# EAGLE schematic GBA SP schematic (EAGLE 7.6.0)

## Sheet 1 of 10
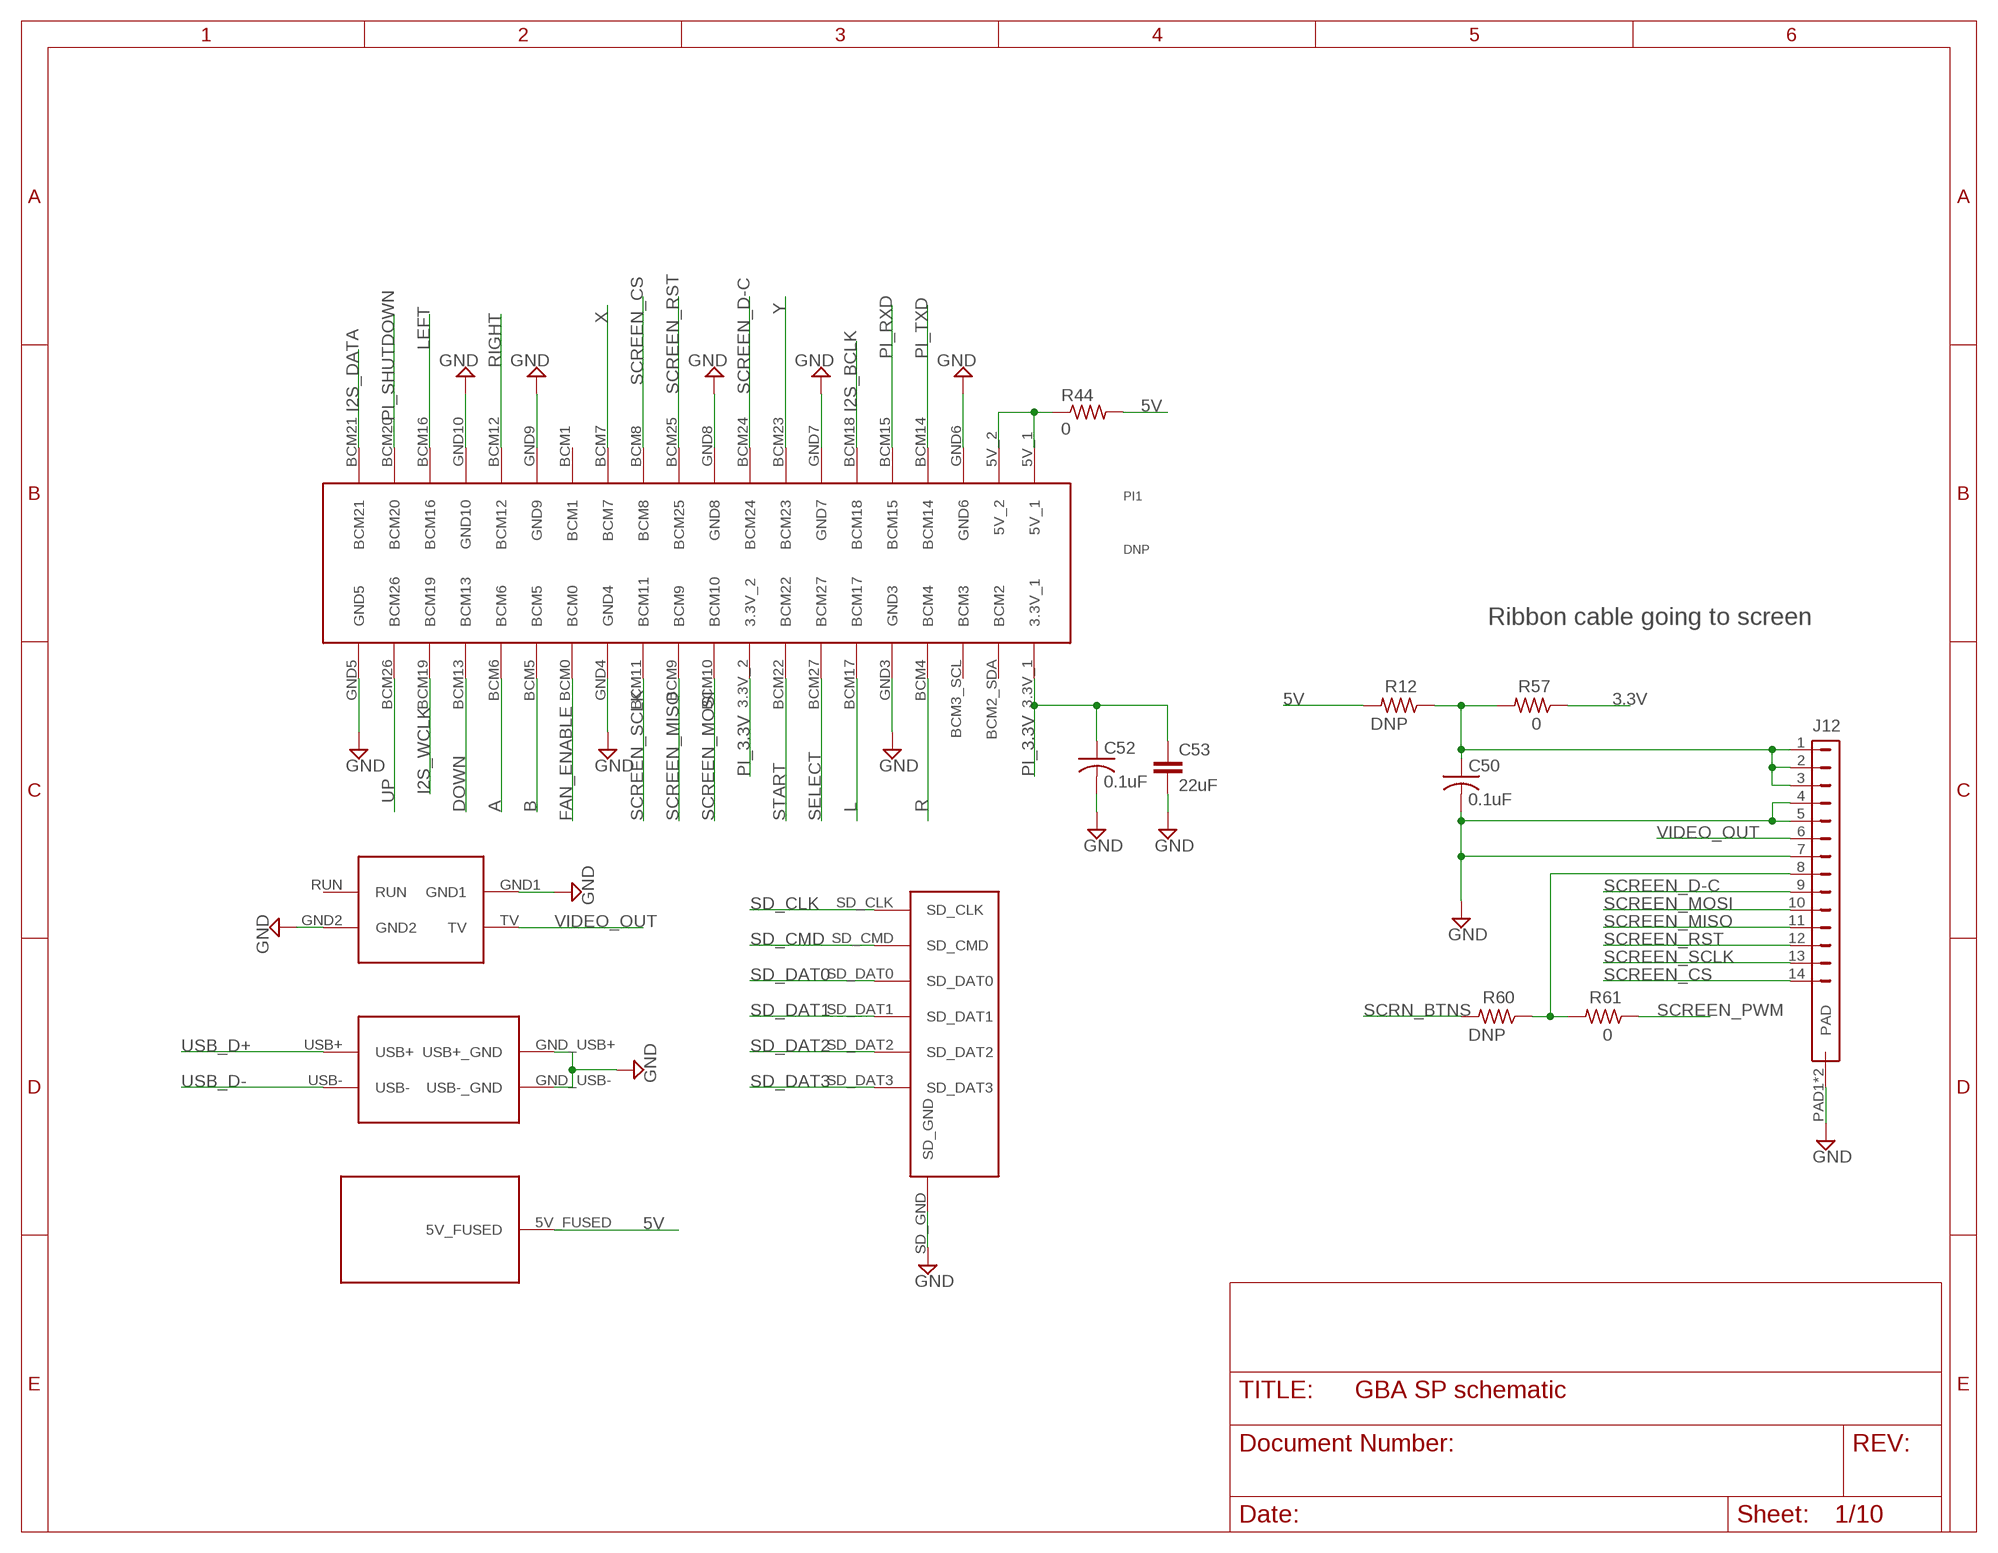
[diagram p0: schematic, sheet 1]

### Parts
C50  0.1uF  C-US0402_REAL  [0402_REAL]
C52  0.1uF  C-US0402_REAL  [0402_REAL]
C53  22uF  C-EUC0805  [C0805]
J12  FPC_14  [FPC_14]
PI1  DNP  PI-ZERO  [PI-ZERO]
R12  DNP  R-US_R0603  [R0603]
R44  0  R-US_R0805  [R0805]
R57  0  R-US_R0603  [R0603]
R60  DNP  R-US_0402_REAL  [0402_REAL]
R61  0  R-US_0402_REAL  [0402_REAL]

### Nets
3.3V: R57.1 ; also sheet 10
5V: PI1.5V_FUSED R12.2 R44.2 ; also sheet 2,3,4,5,6,7,10
A: PI1.BCM6 ; also sheet 2
B: PI1.BCM5 ; also sheet 2
DOWN: PI1.BCM13 ; also sheet 2
FAN_ENABLE: PI1.BCM0 ; also sheet 10
GND: C50.2 C52.2 C53.2 J12.4 J12.5 J12.7 J12.PAD1(PAD) J12.PAD2(PAD) PI1.GND1 PI1.GND2 PI1.GND3 PI1.GND4 PI1.GND5 PI1.GND6 PI1.GND7 PI1.GND8 PI1.GND9 PI1.GND10 PI1.GND_USB+(USB+_GND) PI1.GND_USB-(USB-_GND) PI1.SD_GND ; also sheet 2,3,4,5,6,7,10
I2S_BCLK: PI1.BCM18 ; also sheet 4
I2S_DATA: PI1.BCM21 ; also sheet 4
I2S_WCLK: PI1.BCM19 ; also sheet 4
L: PI1.BCM17 ; also sheet 2
LEFT: PI1.BCM16 ; also sheet 2
N$19: PI1.5V_1 PI1.5V_2 R44.1
N$22: J12.8 R60.1 R61.2
N$23: C50.1 J12.1 J12.2 J12.3 R12.1 R57.2
PI_3.3V: C52.1 C53.1 PI1.3.3V_1 PI1.3.3V_2 ; also sheet 4,6
PI_RXD: PI1.BCM15 ; also sheet 6
PI_SHUTDOWN: PI1.BCM20 ; also sheet 6
PI_TXD: PI1.BCM14 ; also sheet 6
R: PI1.BCM4 ; also sheet 2
RIGHT: PI1.BCM12 ; also sheet 2
SCREEN_CS: J12.14 PI1.BCM8
SCREEN_D-C: J12.9 PI1.BCM24
SCREEN_MISO: J12.11 PI1.BCM9
SCREEN_MOSI: J12.10 PI1.BCM10
SCREEN_PWM: R61.1 ; also sheet 6
SCREEN_RST: J12.12 PI1.BCM25
SCREEN_SCLK: J12.13 PI1.BCM11
SCRN_BTNS: R60.2 ; also sheet 2
SD_CLK: PI1.SD_CLK
SD_CMD: PI1.SD_CMD
SD_DAT0: PI1.SD_DAT0
SD_DAT1: PI1.SD_DAT1
SD_DAT2: PI1.SD_DAT2
SD_DAT3: PI1.SD_DAT3
SELECT: PI1.BCM27 ; also sheet 2
START: PI1.BCM22 ; also sheet 2
UP: PI1.BCM26 ; also sheet 2
USB_D+: PI1.USB+ ; also sheet 7
USB_D-: PI1.USB- ; also sheet 7
VIDEO_OUT: J12.6 PI1.TV
X: PI1.BCM7 ; also sheet 2
Y: PI1.BCM23 ; also sheet 2
Unconnected: PI1.BCM1 PI1.BCM2_SDA(BCM2) PI1.BCM3_SCL(BCM3) PI1.RUN

### Notes on the sheet
- Ribbon cable going to screen

## Sheet 2 of 10
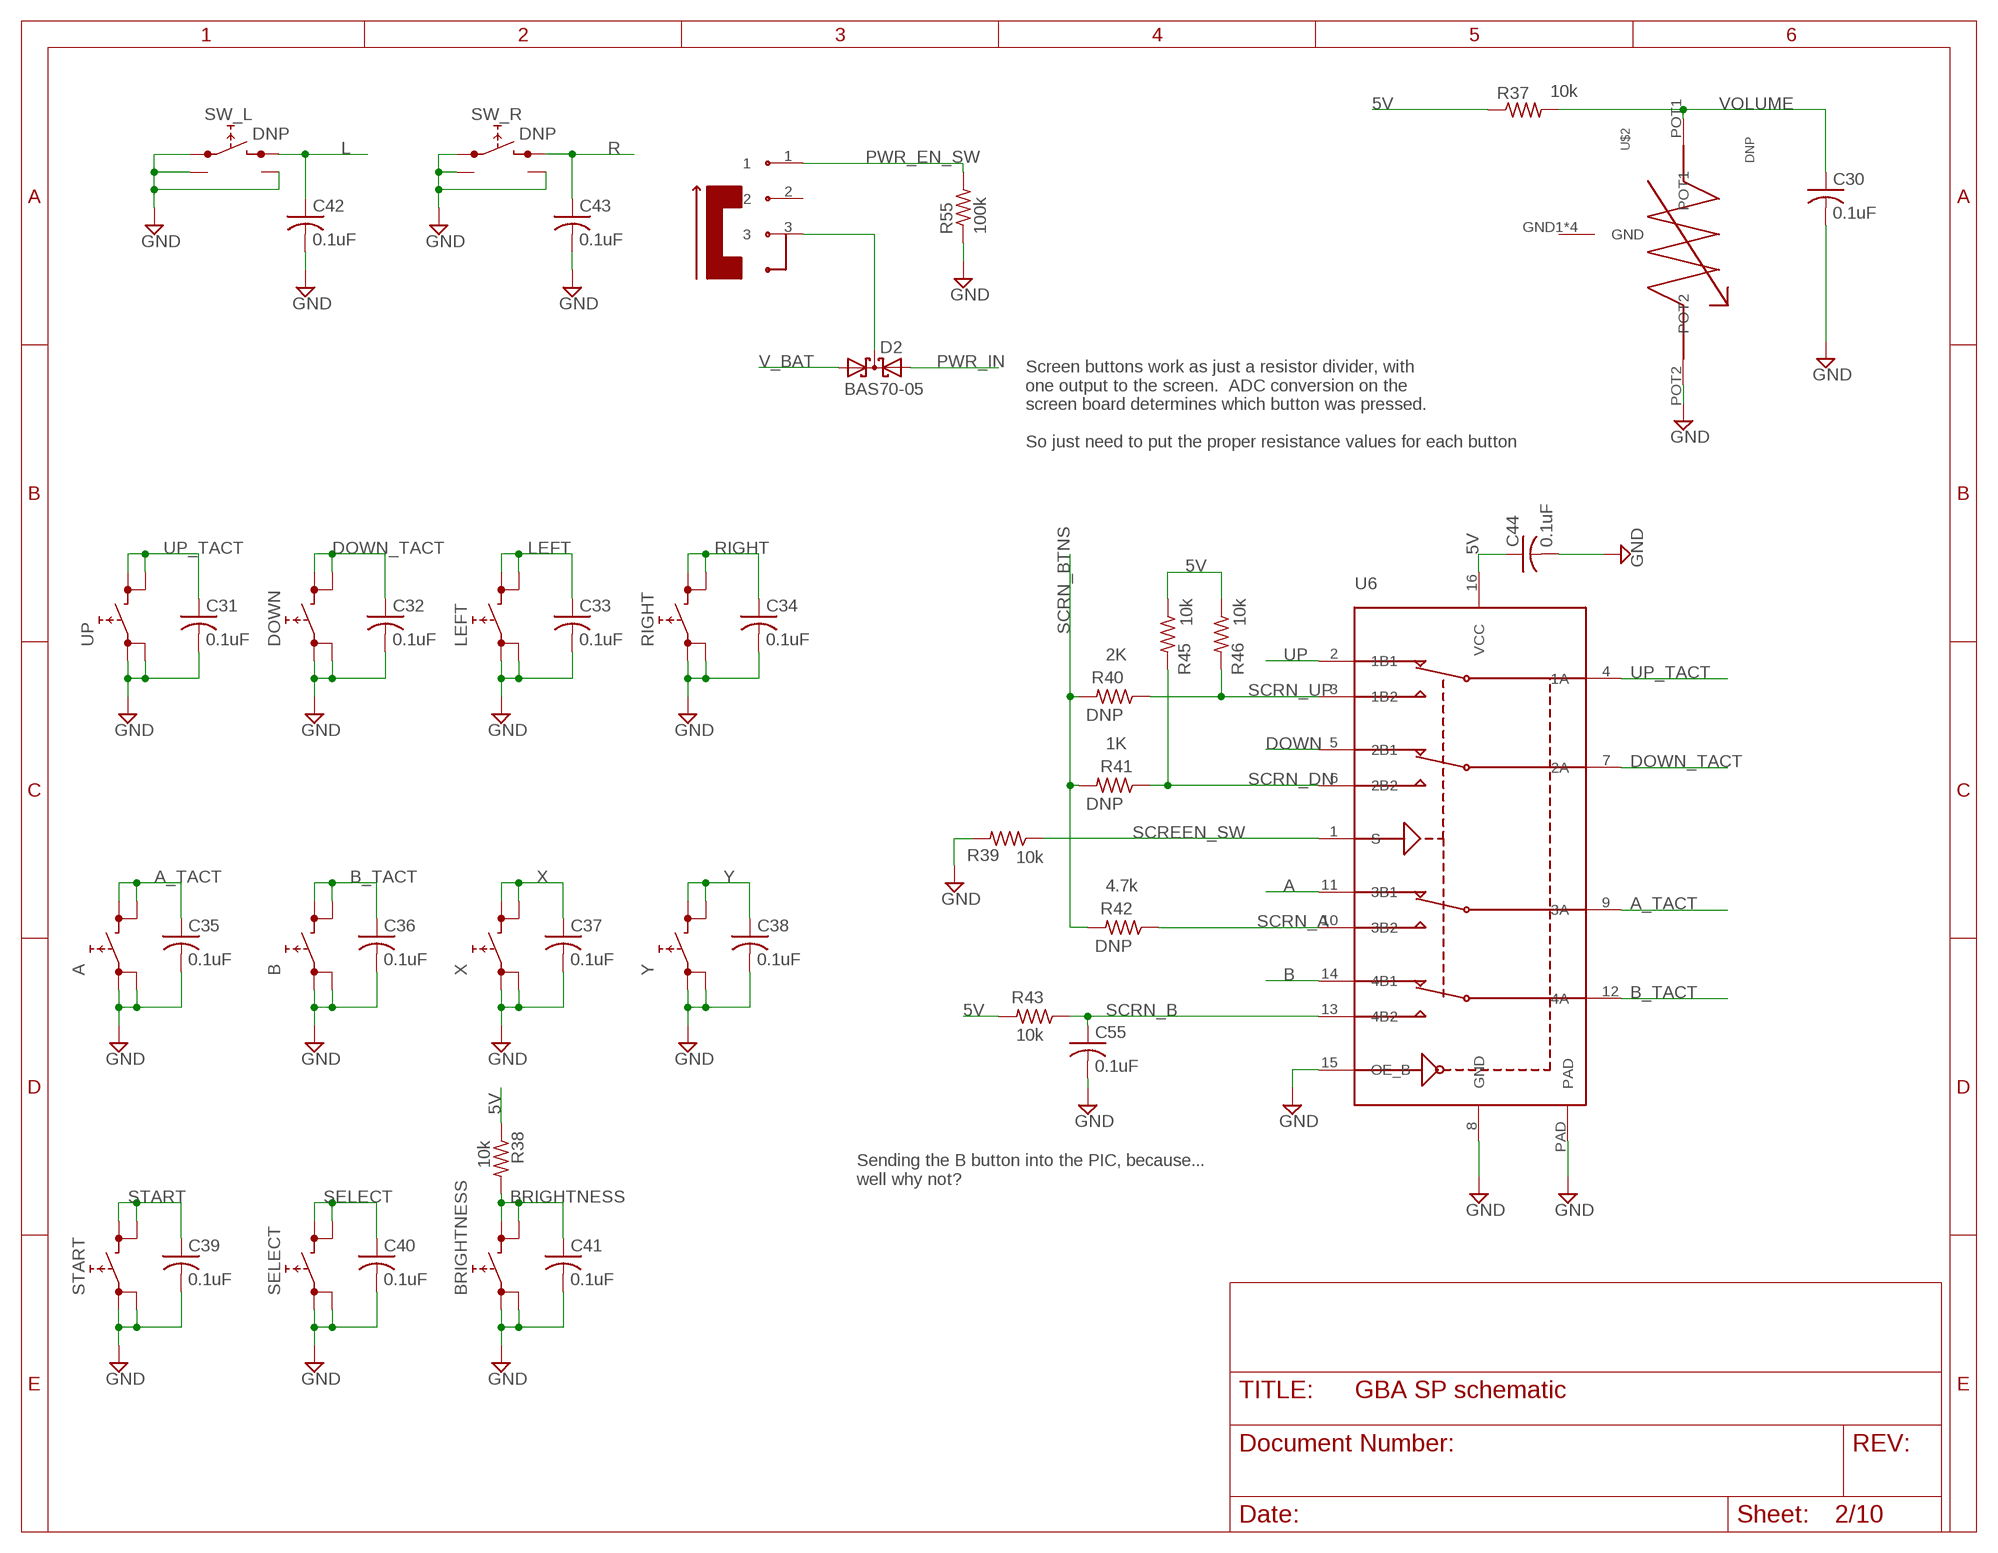
[diagram p1: schematic, sheet 2]

### Parts
A  TACTILEGBA_SP  [GBA_SP_TACT]
B  TACTILEGBA_SP  [GBA_SP_TACT]
BRIGHTNESS  TACTILE  [TL3315]
C30  0.1uF  C-US0402_REAL  [0402_REAL]
C31  0.1uF  C-US0402_REAL  [0402_REAL]
C32  0.1uF  C-US0402_REAL  [0402_REAL]
C33  0.1uF  C-US0402_REAL  [0402_REAL]
C34  0.1uF  C-US0402_REAL  [0402_REAL]
C35  0.1uF  C-US0402_REAL  [0402_REAL]
C36  0.1uF  C-US0402_REAL  [0402_REAL]
C37  0.1uF  C-US0402_REAL  [0402_REAL]
C38  0.1uF  C-US0402_REAL  [0402_REAL]
C39  0.1uF  C-US0402_REAL  [0402_REAL]
C40  0.1uF  C-US0402_REAL  [0402_REAL]
C41  0.1uF  C-US0402_REAL  [0402_REAL]
C42  0.1uF  C-US0402_REAL  [0402_REAL]
C43  0.1uF  C-US0402_REAL  [0402_REAL]
C44  0.1uF  C-US0402_REAL  [0402_REAL]
C55  0.1uF  C-US0402_REAL  [0402_REAL]
D2  BAS70-05  [SOT23]
DOWN  TACTILEGBA_SP  [GBA_SP_TACT]
LEFT  TACTILEGBA_SP  [GBA_SP_TACT]
R37  10k  R-US_0402_REAL  [0402_REAL]
R38  10k  R-US_0402_REAL  [0402_REAL]
R39  10k  R-US_0402_REAL  [0402_REAL]
R40  DNP  R-US_0402_REAL  [0402_REAL]
R41  DNP  R-US_0402_REAL  [0402_REAL]
R42  DNP  R-US_0402_REAL  [0402_REAL]
R43  10k  R-US_0402_REAL  [0402_REAL]
R45  10k  R-US_0402_REAL  [0402_REAL]
R46  10k  R-US_0402_REAL  [0402_REAL]
R55  100k  R-US_0402_REAL  [0402_REAL]
RIGHT  TACTILEGBA_SP  [GBA_SP_TACT]
SELECT  TACTILE  [TL3315]
START  TACTILE  [TL3315]
SW_L  DNP  GBA-SHOULDER-SW  [GBA-SHOULDER-SW]
SW_R  DNP  GBA-SHOULDER-SW  [GBA-SHOULDER-SW]
U6  SN74CBT3257C  [VQFN16]
U$1  CSS-1210  [CSS-1210]
U$2  DNP  GBA-POT  [GBA-POT]
UP  TACTILEGBA_SP  [GBA_SP_TACT]
X  TACTILEGBA_SP  [GBA_SP_TACT]
Y  TACTILEGBA_SP  [GBA_SP_TACT]

### Nets
5V: C44.1 R37.1 R38.1 R43.2 R45.1 R46.1 U6.16(VCC) ; also sheet 1,3,4,5,6,7,10
A: U6.11(3B1) ; also sheet 1
A_TACT: A.2 A.4 C35.1 U6.9(3A)
B: U6.14(4B1) ; also sheet 1
B_TACT: B.2 B.4 C36.1 U6.12(4A)
BRIGHTNESS: BRIGHTNESS.3 BRIGHTNESS.4 C41.1 R38.2 ; also sheet 6
DOWN: U6.5(2B1) ; also sheet 1
DOWN_TACT: C32.1 DOWN.2 DOWN.4 U6.7(2A)
GND: A.1 A.3 B.1 B.3 BRIGHTNESS.1 BRIGHTNESS.2 C30.2 C31.2 C32.2 C33.2 C34.2 C35.2 C36.2 C37.2 C38.2 C39.2 C40.2 C41.2 C42.2 C43.2 C44.2 C55.2 DOWN.1 DOWN.3 LEFT.1 LEFT.3 R39.2 R55.1 RIGHT.1 RIGHT.3 SELECT.1 SELECT.2 START.1 START.2 SW_L.A SW_L.GND1 SW_L.GND2 SW_R.A SW_R.GND1 SW_R.GND2 U6.8(GND) U6.15(OE_B) U6.PAD U$2.POT2 UP.1 UP.3 X.1 X.3 Y.1 Y.3 ; also sheet 1,3,4,5,6,7,10
L: C42.1 SW_L.B ; also sheet 1
LEFT: C33.1 LEFT.2 LEFT.4 ; also sheet 1
N$25: D2.3(C) U$1.3
PWR_EN_SW: R55.2 U$1.1 ; also sheet 3
PWR_IN: D2.2(A2) ; also sheet 3,5,7
R: C43.1 SW_R.B ; also sheet 1
RIGHT: C34.1 RIGHT.2 RIGHT.4 ; also sheet 1
SCREEN_SW: R39.1 U6.1(S) ; also sheet 6
SCRN_A: R42.1 U6.10(3B2)
SCRN_B: C55.1 R43.1 U6.13(4B2) ; also sheet 6
SCRN_BTNS: R40.2 R41.2 R42.2 ; also sheet 1
SCRN_DN: R41.1 R45.2 U6.6(2B2) ; also sheet 6
SCRN_UP: R40.1 R46.2 U6.3(1B2) ; also sheet 6
SELECT: C40.1 SELECT.3 SELECT.4 ; also sheet 1
START: C39.1 START.3 START.4 ; also sheet 1
UP: U6.2(1B1) ; also sheet 1
UP_TACT: C31.1 U6.4(1A) UP.2 UP.4
V_BAT: D2.1(A1) ; also sheet 3,5
VOLUME: C30.1 R37.2 U$2.POT1 ; also sheet 6
X: C37.1 X.2 X.4 ; also sheet 1
Y: C38.1 Y.2 Y.4 ; also sheet 1
Unconnected: U$1.2 U$2.GND1(GND) U$2.GND2(GND) U$2.GND3(GND) U$2.GND4(GND)

### Notes on the sheet
- Screen buttons work as just a resistor divider, with
  one output to the screen.  ADC conversion on the
  screen board determines which button was pressed.  
  
  So just need to put the proper resistance values for each button
- 2K
- 1K
- 4.7k
- Sending the B button into the PIC, because...
  well why not?

## Sheet 3 of 10
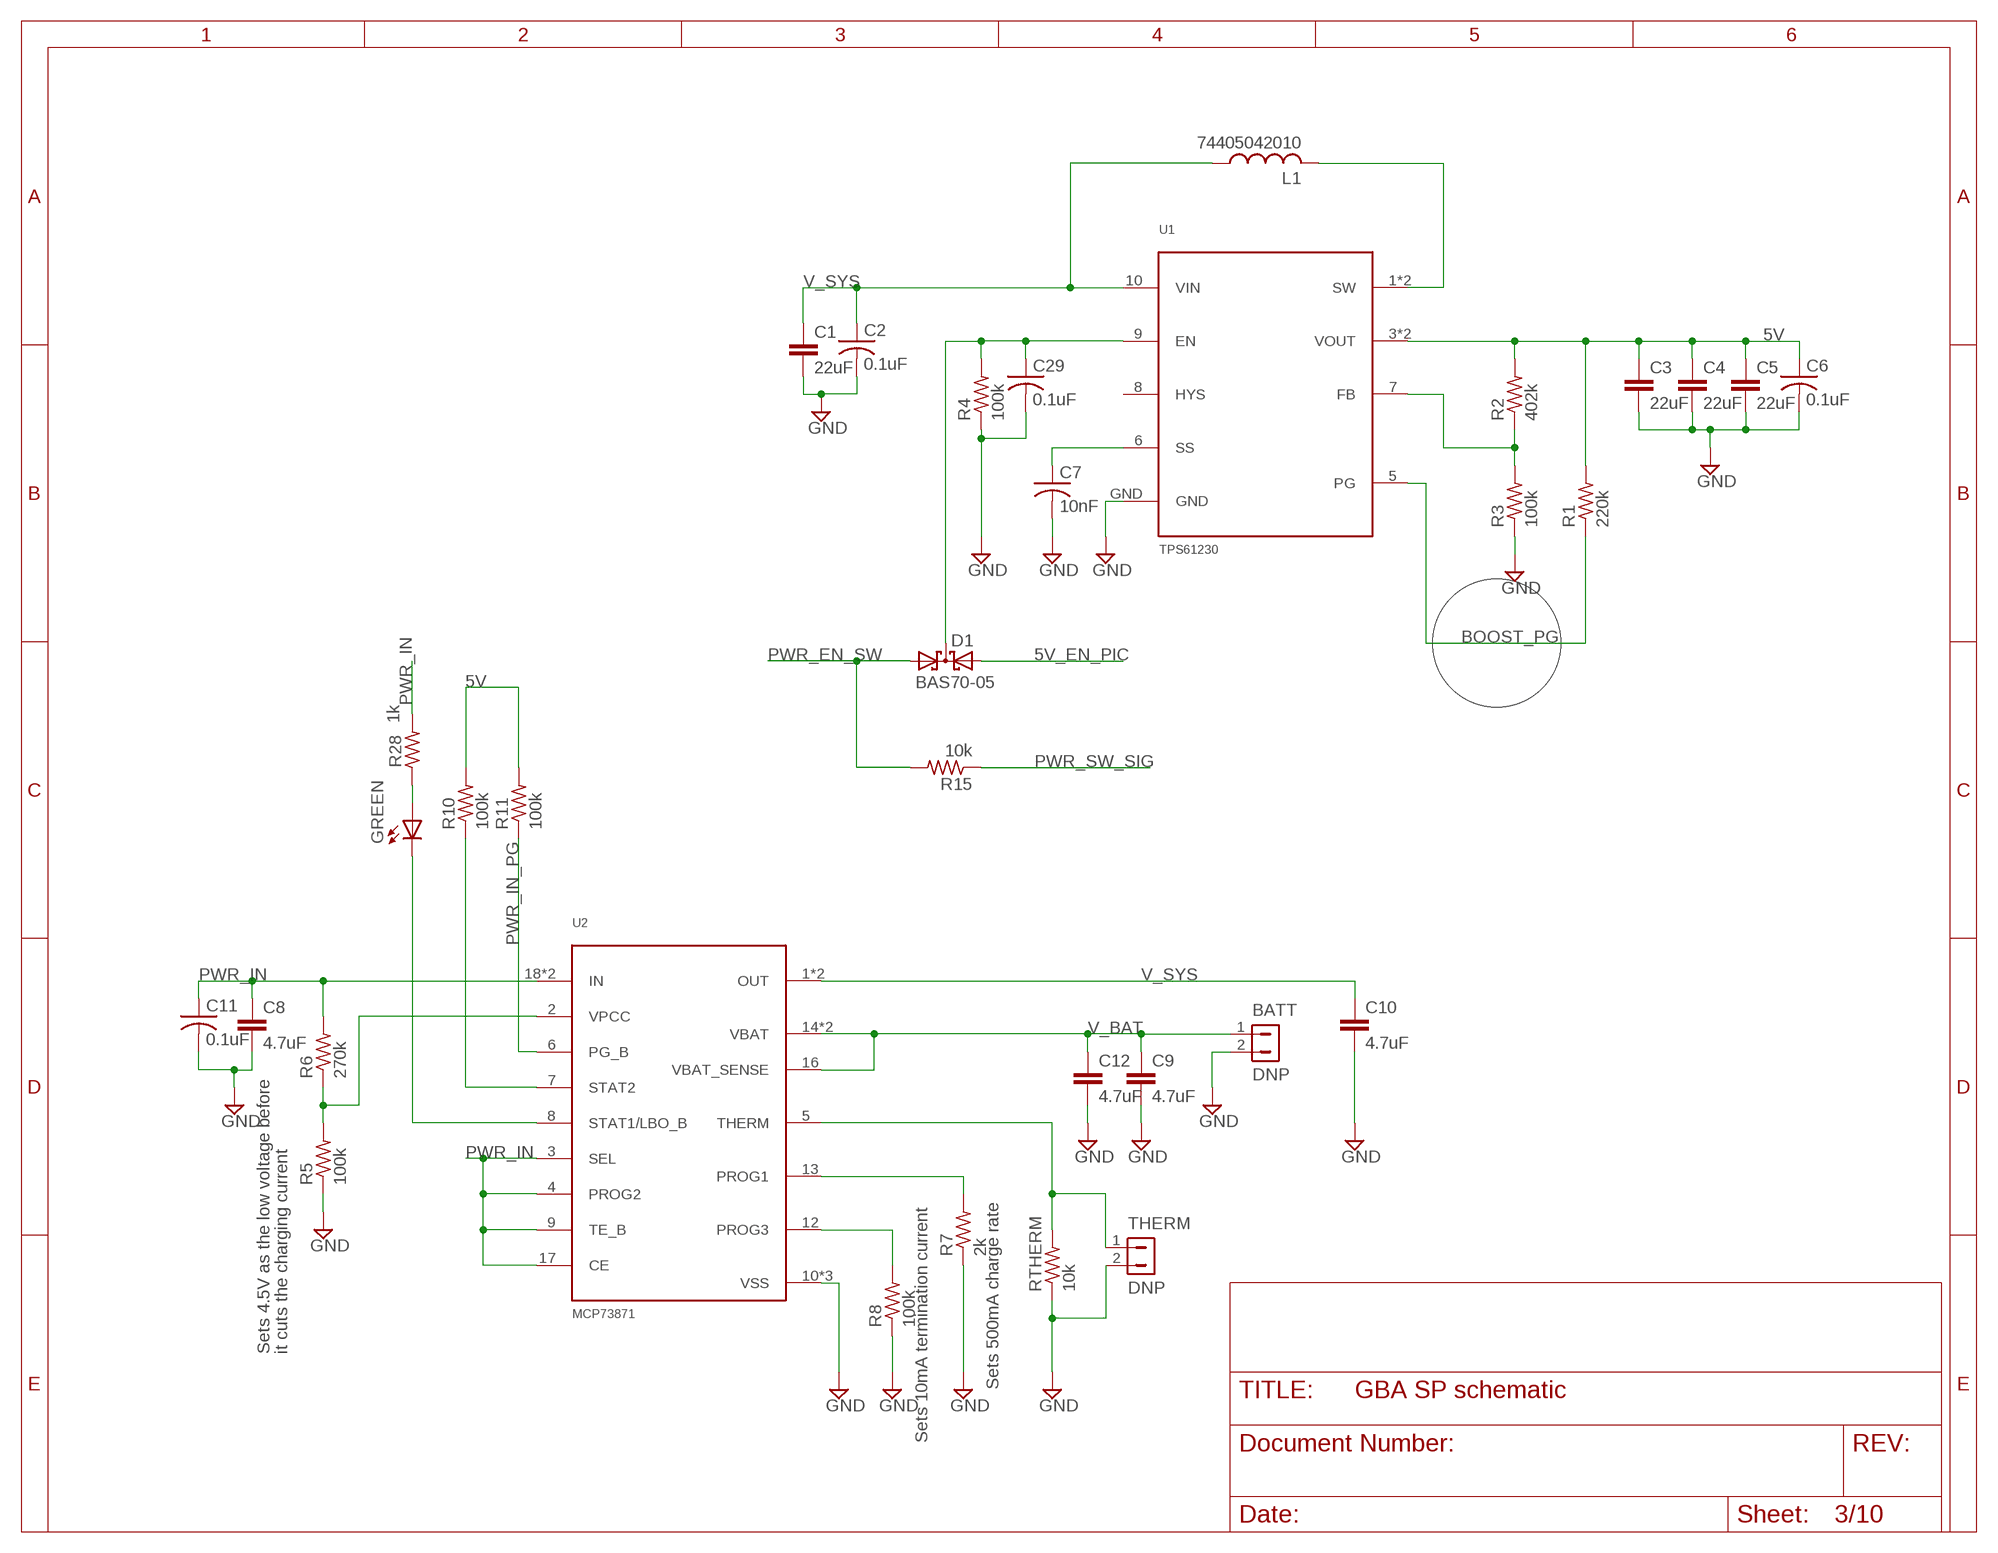
[diagram p2: schematic, sheet 3]

### Parts
BATT  DNP  HEADER-1X2  [HEADER-1X2]
C1  22uF  C-EUC0805  [C0805]
C2  0.1uF  C-US0402_REAL  [0402_REAL]
C3  22uF  C-EUC0805  [C0805]
C4  22uF  C-EUC0805  [C0805]
C5  22uF  C-EUC0805  [C0805]
C6  0.1uF  C-US0402_REAL  [0402_REAL]
C7  10nF  C-US0402_REAL  [0402_REAL]
C8  4.7uF  C-EUC0603  [C0603]
C9  4.7uF  C-EUC0603  [C0603]
C10  4.7uF  C-EUC0603  [C0603]
C11  0.1uF  C-US0402_REAL  [0402_REAL]
C12  4.7uF  C-EUC0603  [C0603]
C29  0.1uF  C-US0402_REAL  [0402_REAL]
D1  BAS70-05  [SOT23]
GREEN  LEDCHIP-LED0603  [CHIP-LED0603]
L1  74405042010  XFL4020-102MEB  [XFL4020-102MEB]
R1  220k  R-US_R0603  [R0603]
R2  402k  R-US_0402_REAL  [0402_REAL]
R3  100k  R-US_0402_REAL  [0402_REAL]
R4  100k  R-US_0402_REAL  [0402_REAL]
R5  100k  R-US_0402_REAL  [0402_REAL]
R6  270k  R-US_R0603  [R0603]
R7  2k  R-US_0402_REAL  [0402_REAL]
R8  100k  R-US_0402_REAL  [0402_REAL]
R10  100k  R-US_0402_REAL  [0402_REAL]
R11  100k  R-US_0402_REAL  [0402_REAL]
R15  10k  R-US_0402_REAL  [0402_REAL]
R28  1k  R-US_0402_REAL  [0402_REAL]
RTHERM  10k  R-US_0402_REAL  [0402_REAL]
THERM  DNP  DF13-2THIN  [DF13-2_THIN]
U1  TPS61230  [VSON10]
U2  MCP73871  [QFN20]

### Nets
5V: C3.1 C4.1 C5.1 C6.1 R1.2 R2.2 R10.2 R11.2 U1.3(VOUT) U1.4(VOUT) ; also sheet 1,2,4,5,6,7,10
5V_EN_PIC: D1.2(A2) ; also sheet 6
BOOST_PG: R1.1 U1.5(PG)
GND: BATT.2 C1.2 C2.2 C3.2 C4.2 C5.2 C6.2 C7.2 C8.2 C9.2 C10.2 C11.2 C12.2 C29.2 R3.1 R4.1 R5.1 R7.1 R8.1 RTHERM.1 THERM.2 U1.GND U2.10(VSS) U2.11(VSS) U2.PAD(VSS) ; also sheet 1,2,4,5,6,7,10
N$1: C29.1 D1.3(C) R4.2 U1.9(EN)
N$2: L1.2 U1.1(SW) U1.2(SW)
N$3: R2.1 R3.2 U1.7(FB)
N$4: R7.2 U2.13(PROG1)
N$5: R5.2 R6.1 U2.2(VPCC)
N$6: C7.1 U1.6(SS)
N$7: R8.2 U2.12(PROG3)
N$8: RTHERM.2 THERM.1 U2.5(THERM)
N$21: GREEN.A R28.1
PWR_EN_SW: D1.1(A1) R15.2 ; also sheet 2
PWR_IN: C8.1 C11.1 R6.2 R28.2 U2.3(SEL) U2.4(PROG2) U2.9(TE_B) U2.17(CE) U2.18(IN) U2.19(IN) ; also sheet 2,5,7
PWR_IN_PG: R11.1 U2.6(PG_B) ; also sheet 6
PWR_SW_SIG: R15.1 ; also sheet 6
STAT1: GREEN.C U2.8(STAT1/LBO_B)
STAT2: R10.1 U2.7(STAT2)
V_BAT: BATT.1 C9.1 C12.1 U2.14(VBAT) U2.15(VBAT) U2.16(VBAT_SENSE) ; also sheet 2,5
V_SYS: C1.1 C2.1 C10.1 L1.1 U1.10(VIN) U2.1(OUT) U2.20(OUT)
Unconnected: U1.8(HYS)

### Notes on the sheet
- Sets 4.5V as the low voltage before | it cuts the charging current
- Sets 500mA charge rate
- Sets 10mA termination current

## Sheet 4 of 10
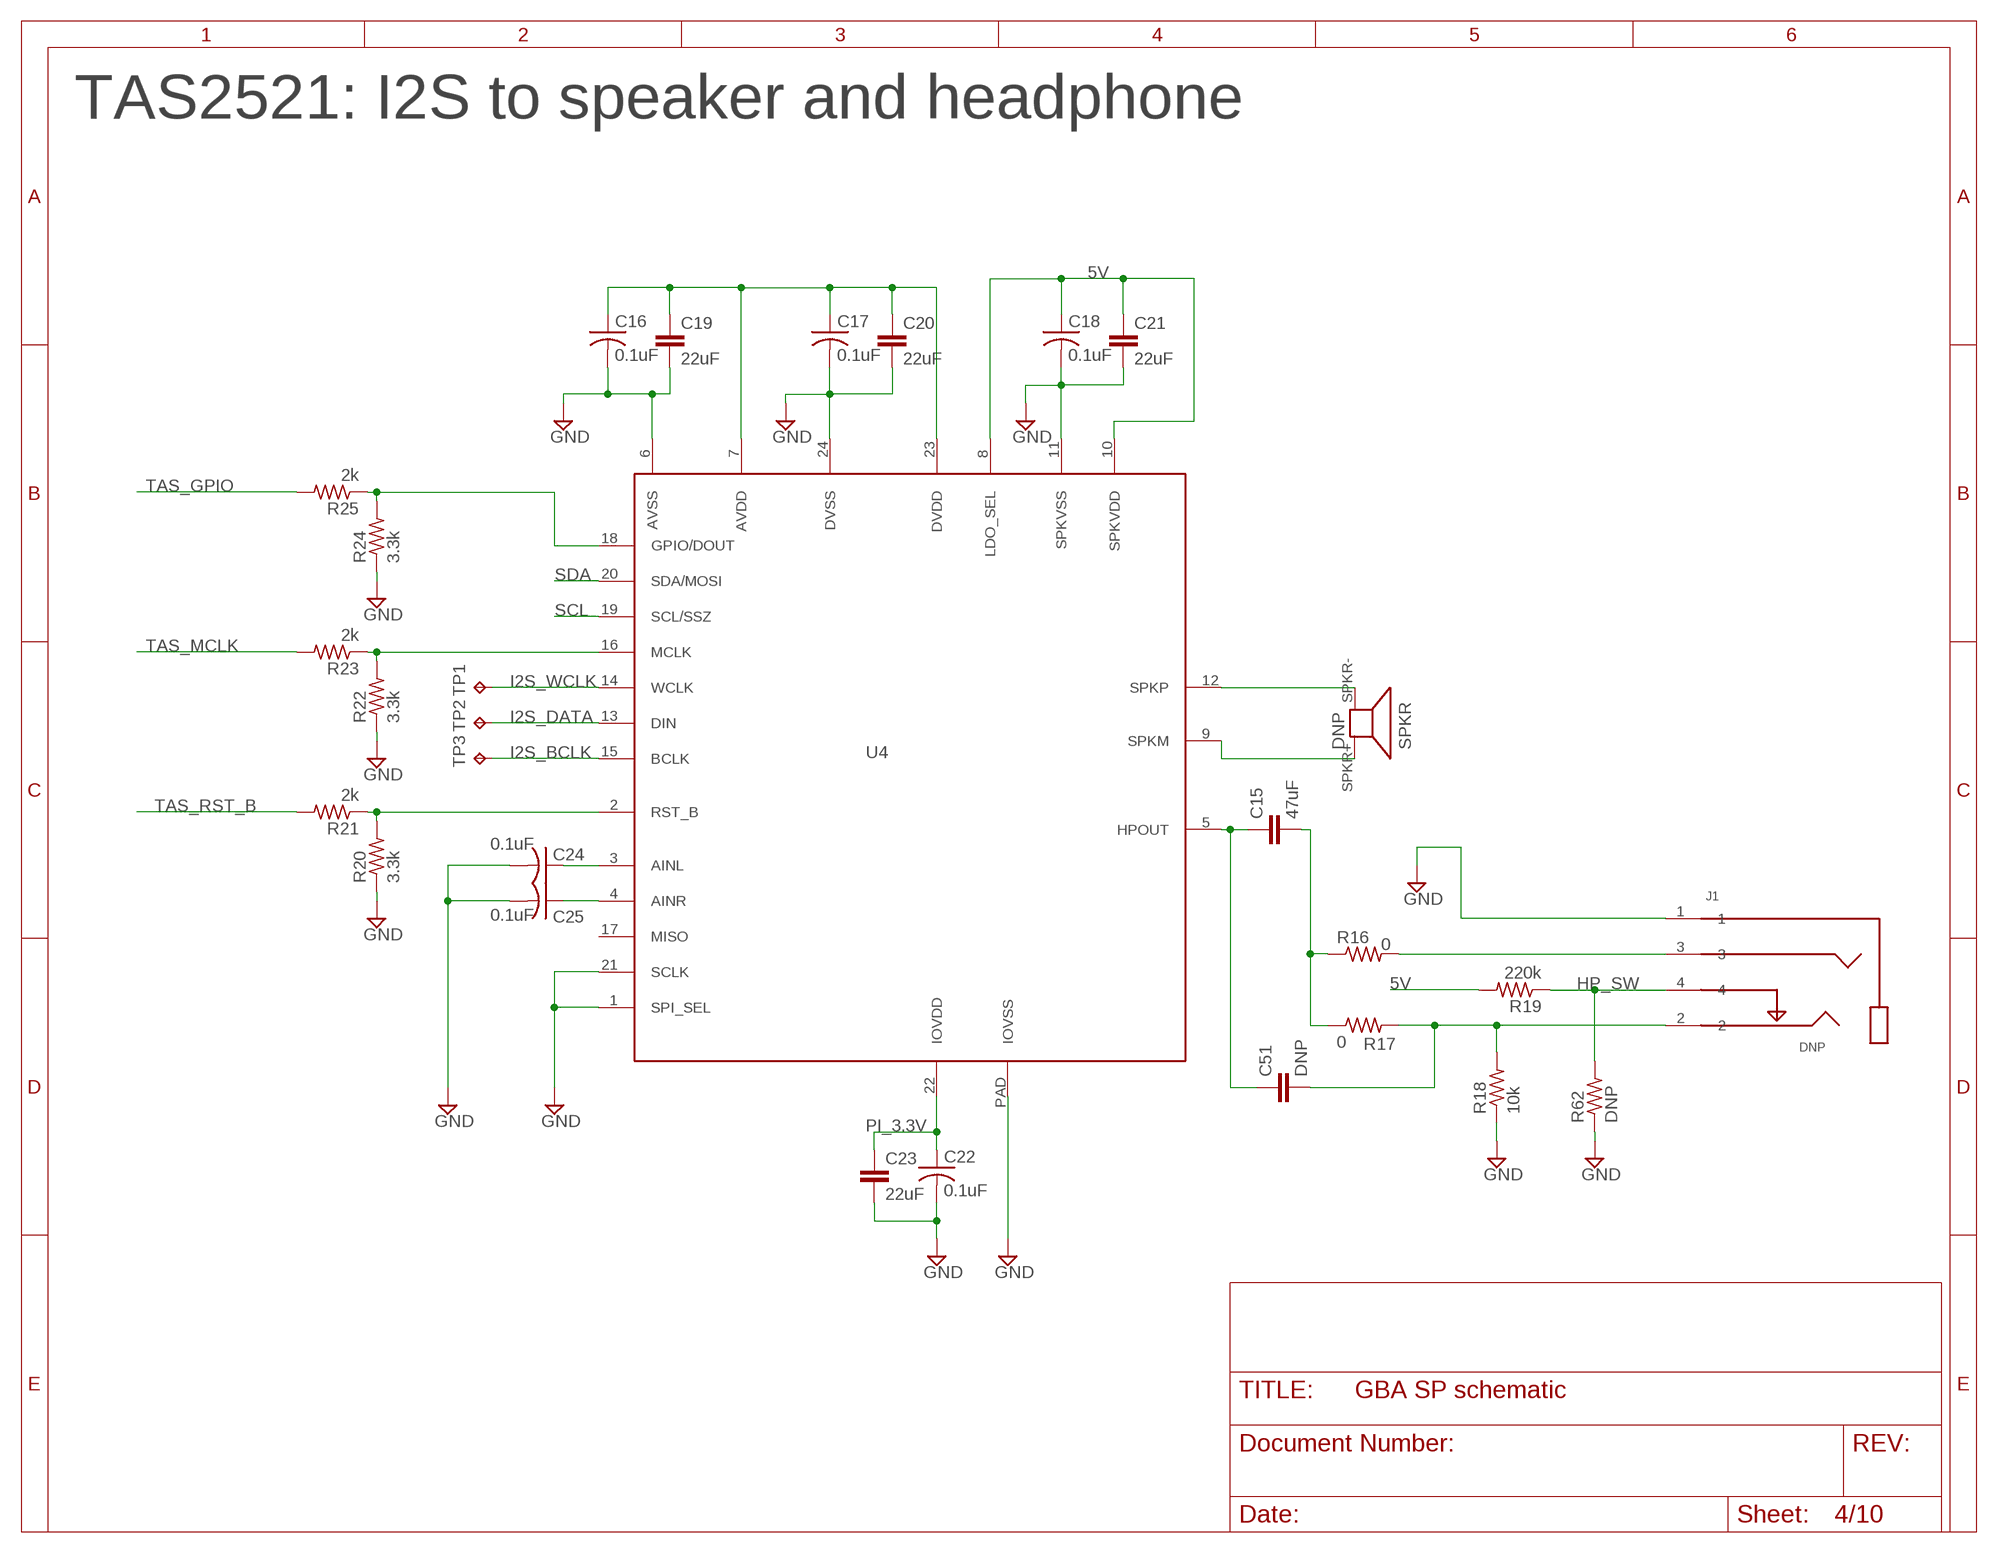
[diagram p3: schematic, sheet 4]

### Parts
C15  47uF  C-EUC0805  [C0805]
C16  0.1uF  C-US0402_REAL  [0402_REAL]
C17  0.1uF  C-US0402_REAL  [0402_REAL]
C18  0.1uF  C-US0402_REAL  [0402_REAL]
C19  22uF  C-EUC0805  [C0805]
C20  22uF  C-EUC0805  [C0805]
C21  22uF  C-EUC0805  [C0805]
C22  0.1uF  C-US0402_REAL  [0402_REAL]
C23  22uF  C-EUC0805  [C0805]
C24  0.1uF  C-US0402_REAL  [0402_REAL]
C25  0.1uF  C-US0402_REAL  [0402_REAL]
C51  DNP  C-EUC0805  [C0805]
J1  DNP  HEADPHONE_JACK  [HEADPHONE_JACK]
R16  0  R-US_0402_REAL  [0402_REAL]
R17  0  R-US_0402_REAL  [0402_REAL]
R18  10k  R-US_0402_REAL  [0402_REAL]
R19  220k  R-US_R0603  [R0603]
R20  3.3k  R-US_0402_REAL  [0402_REAL]
R21  2k  R-US_0402_REAL  [0402_REAL]
R22  3.3k  R-US_0402_REAL  [0402_REAL]
R23  2k  R-US_0402_REAL  [0402_REAL]
R24  3.3k  R-US_0402_REAL  [0402_REAL]
R25  2k  R-US_0402_REAL  [0402_REAL]
R62  DNP  R-US_0402_REAL  [0402_REAL]
SPKR  DNP  GBA-SPKR  [GBA-SPKR]
TP1  TPTP06R  [TP06R]
TP2  TPTP06R  [TP06R]
TP3  TPTP06R  [TP06R]
U4  TAS2521  [QFN24]

### Nets
5V: C18.1 C21.1 R19.2 U4.8(LDO_SEL) U4.10(SPKVDD) ; also sheet 1,2,3,5,6,7,10
GND: C16.2 C17.2 C18.2 C19.2 C20.2 C21.2 C22.2 C23.2 C24.2 C25.2 J1.1 R18.1 R20.1 R22.1 R24.1 R62.1 U4.1(SPI_SEL) U4.6(AVSS) U4.11(SPKVSS) U4.21(SCLK) U4.24(DVSS) U4.PAD(IOVSS) ; also sheet 1,2,3,5,6,7,10
HP_SW: J1.4 R19.1 R62.2 ; also sheet 6
I2S_BCLK: TP3.TP U4.15(BCLK) ; also sheet 1
I2S_DATA: TP2.TP U4.13(DIN) ; also sheet 1
I2S_WCLK: TP1.TP U4.14(WCLK) ; also sheet 1
N$10: SPKR.SPKR-(-) U4.12(SPKP)
N$11: SPKR.SPKR+(+) U4.9(SPKM)
N$12: C15.1 C51.1 U4.5(HPOUT)
N$13: C15.2 R16.1 R17.1
N$14: J1.3 R16.2
N$15: C51.2 J1.2 R17.2 R18.2
N$16: C16.1 C17.1 C19.1 C20.1 U4.7(AVDD) U4.23(DVDD)
N$26: R20.2 R21.1 U4.2(RST_B)
N$27: R22.2 R23.1 U4.16(MCLK)
N$28: R24.2 R25.1 U4.18(GPIO/DOUT)
N$34: C24.1 U4.3(AINL)
N$35: C25.1 U4.4(AINR)
PI_3.3V: C22.1 C23.1 U4.22(IOVDD) ; also sheet 1,6
SCL: U4.19(SCL/SSZ) ; also sheet 5,6
SDA: U4.20(SDA/MOSI) ; also sheet 5,6
TAS_GPIO: R25.2
TAS_MCLK: R23.2
TAS_RST_B: R21.2 ; also sheet 6
Unconnected: U4.17(MISO)

### Notes on the sheet
- TAS2521: I2S to speaker and headphone

## Sheet 5 of 10
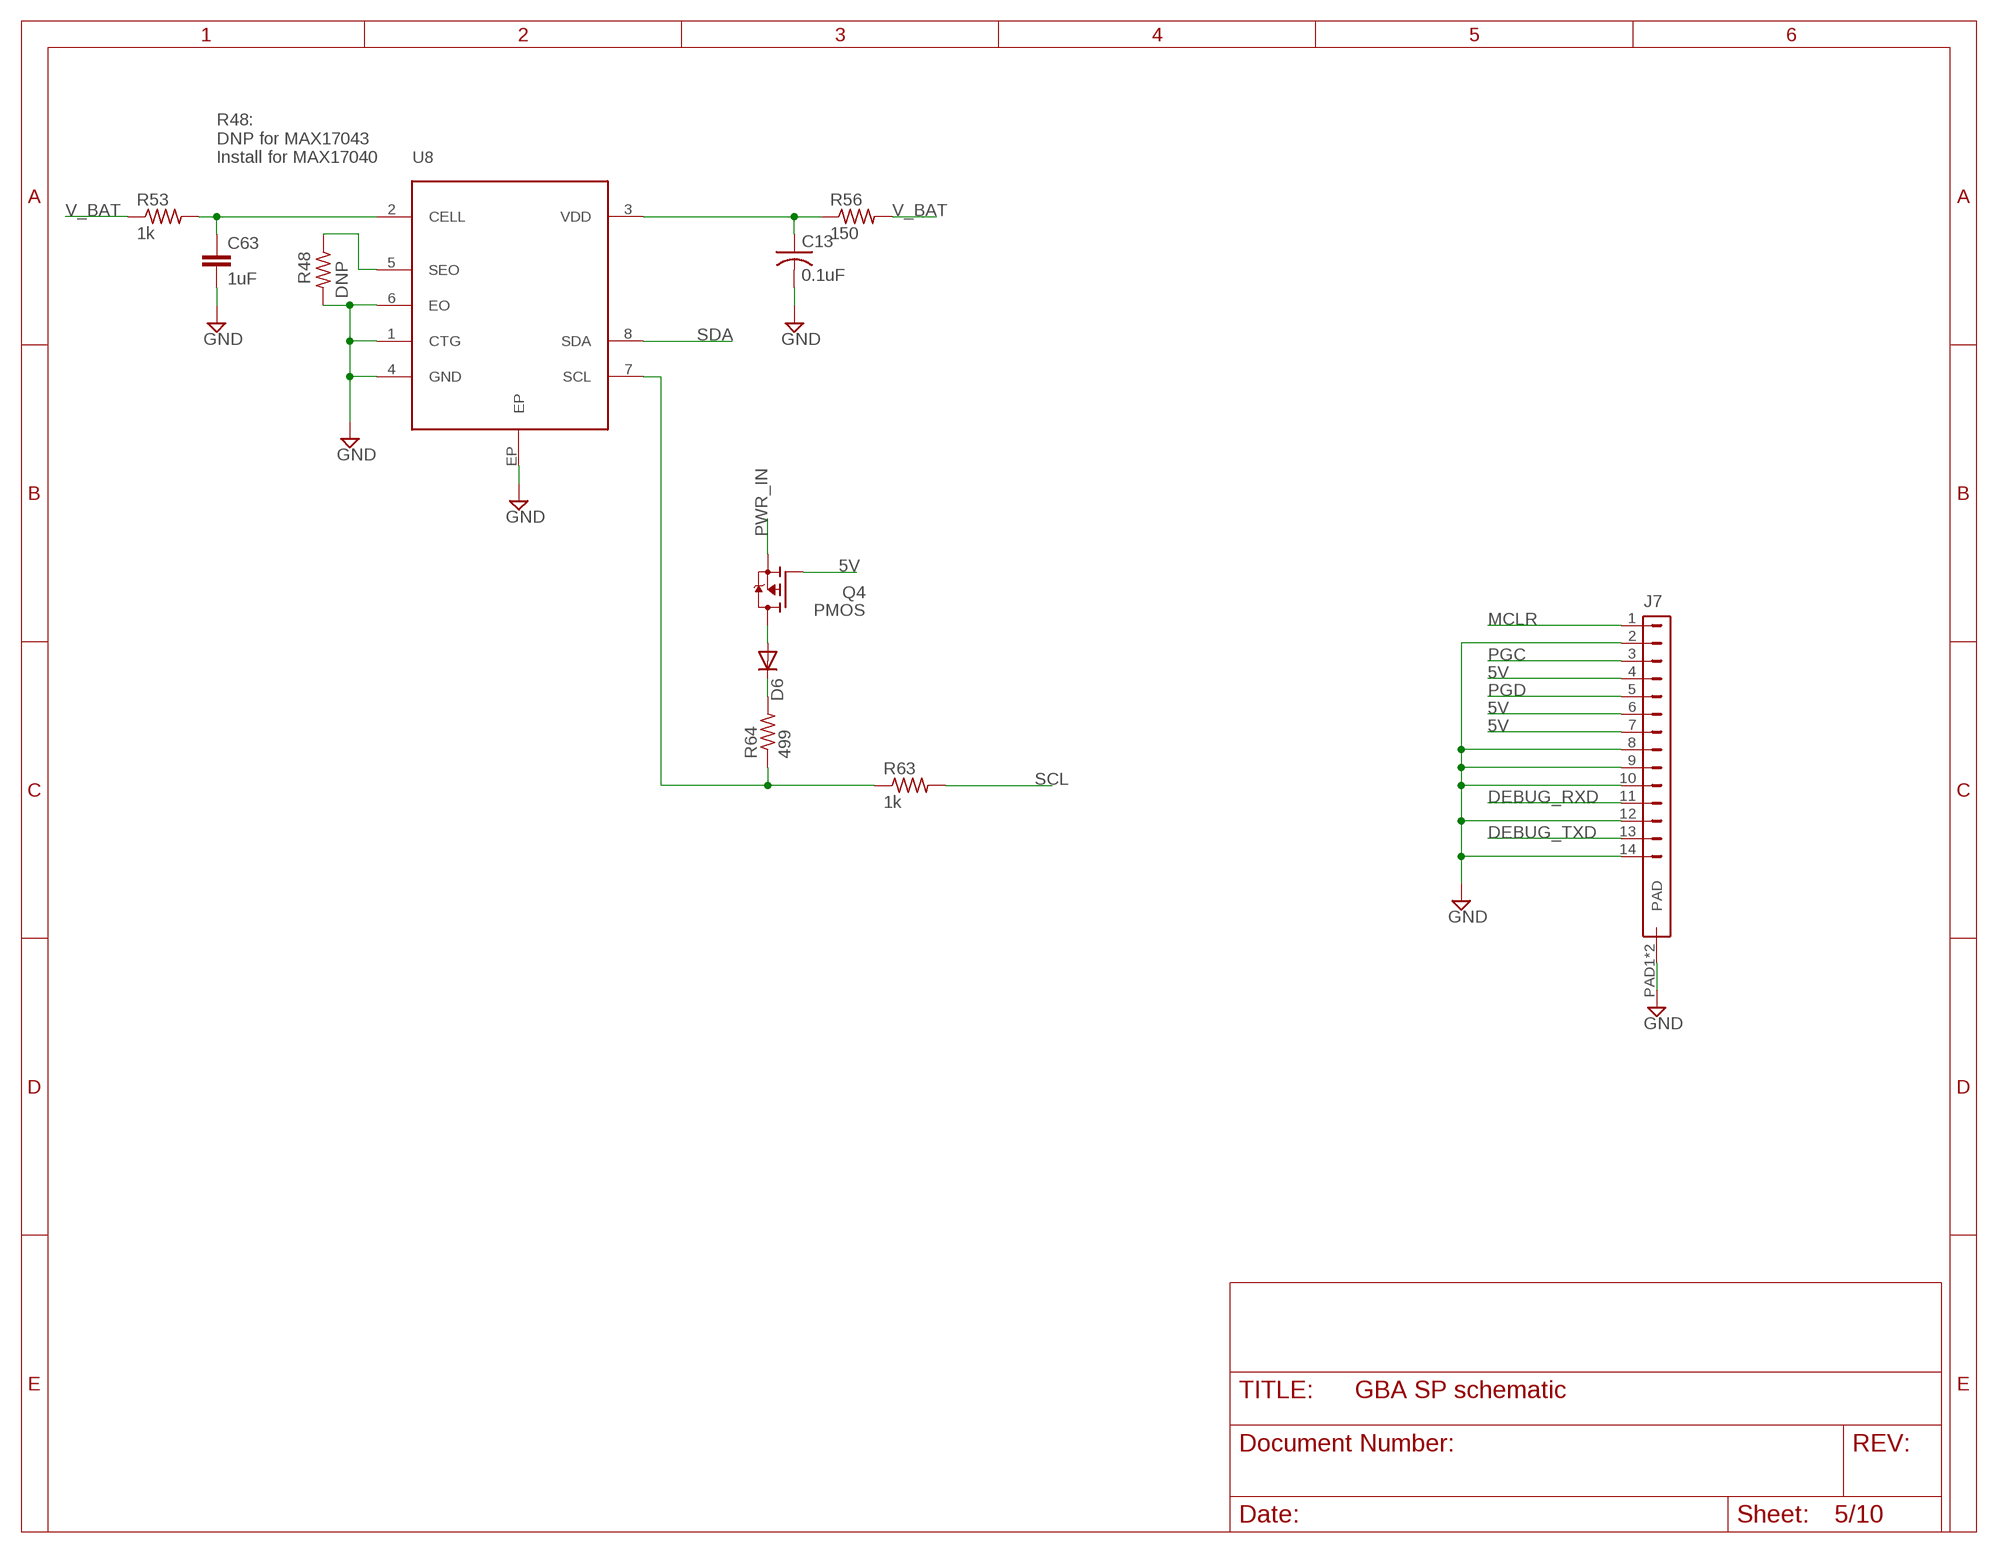
[diagram p4: schematic, sheet 5]

### Parts
C13  0.1uF  C-US0402_REAL  [0402_REAL]
C63  1uF  C-EU0402_REAL  [0402_REAL]
D6  DIODE-SOD523  [SOD523]
J7  FPC_14  [FPC_14]
Q4  PMOS  [SC70]
R48  DNP  R-US_0402_REAL  [0402_REAL]
R53  1k  R-US_0402_REAL  [0402_REAL]
R56  150  R-US_0402_REAL  [0402_REAL]
R63  1k  R-US_0402_REAL  [0402_REAL]
R64  499  R-US_0402_REAL  [0402_REAL]
U8  MAX17040  [TDFN-2X3]

### Nets
5V: J7.4 J7.6 J7.7 Q4.G ; also sheet 1,2,3,4,6,7,10
DEBUG_RXD: J7.11 ; also sheet 6
DEBUG_TXD: J7.13 ; also sheet 6
GND: C13.2 C63.2 J7.2 J7.8 J7.9 J7.10 J7.12 J7.14 J7.PAD1(PAD) J7.PAD2(PAD) R48.2 U8.1(CTG) U8.4(GND) U8.6(EO) U8.EP ; also sheet 1,2,3,4,6,7,10
MCLR: J7.1 ; also sheet 6
N$9: R48.1 U8.5(SEO)
N$32: D6.C R64.2
N$40: D6.A Q4.D
N$48: C63.1 R53.2 U8.2(CELL)
N$50: C13.1 R56.1 U8.3(VDD)
N$99: R63.1 R64.1 U8.7(SCL)
PGC: J7.3 ; also sheet 6
PGD: J7.5 ; also sheet 6
PWR_IN: Q4.S ; also sheet 2,3,7
SCL: R63.2 ; also sheet 4,6
SDA: U8.8(SDA) ; also sheet 4,6
V_BAT: R53.1 R56.2 ; also sheet 2,3

### Notes on the sheet
- R48:
  DNP for MAX17043
  Install for MAX17040

## Sheet 6 of 10
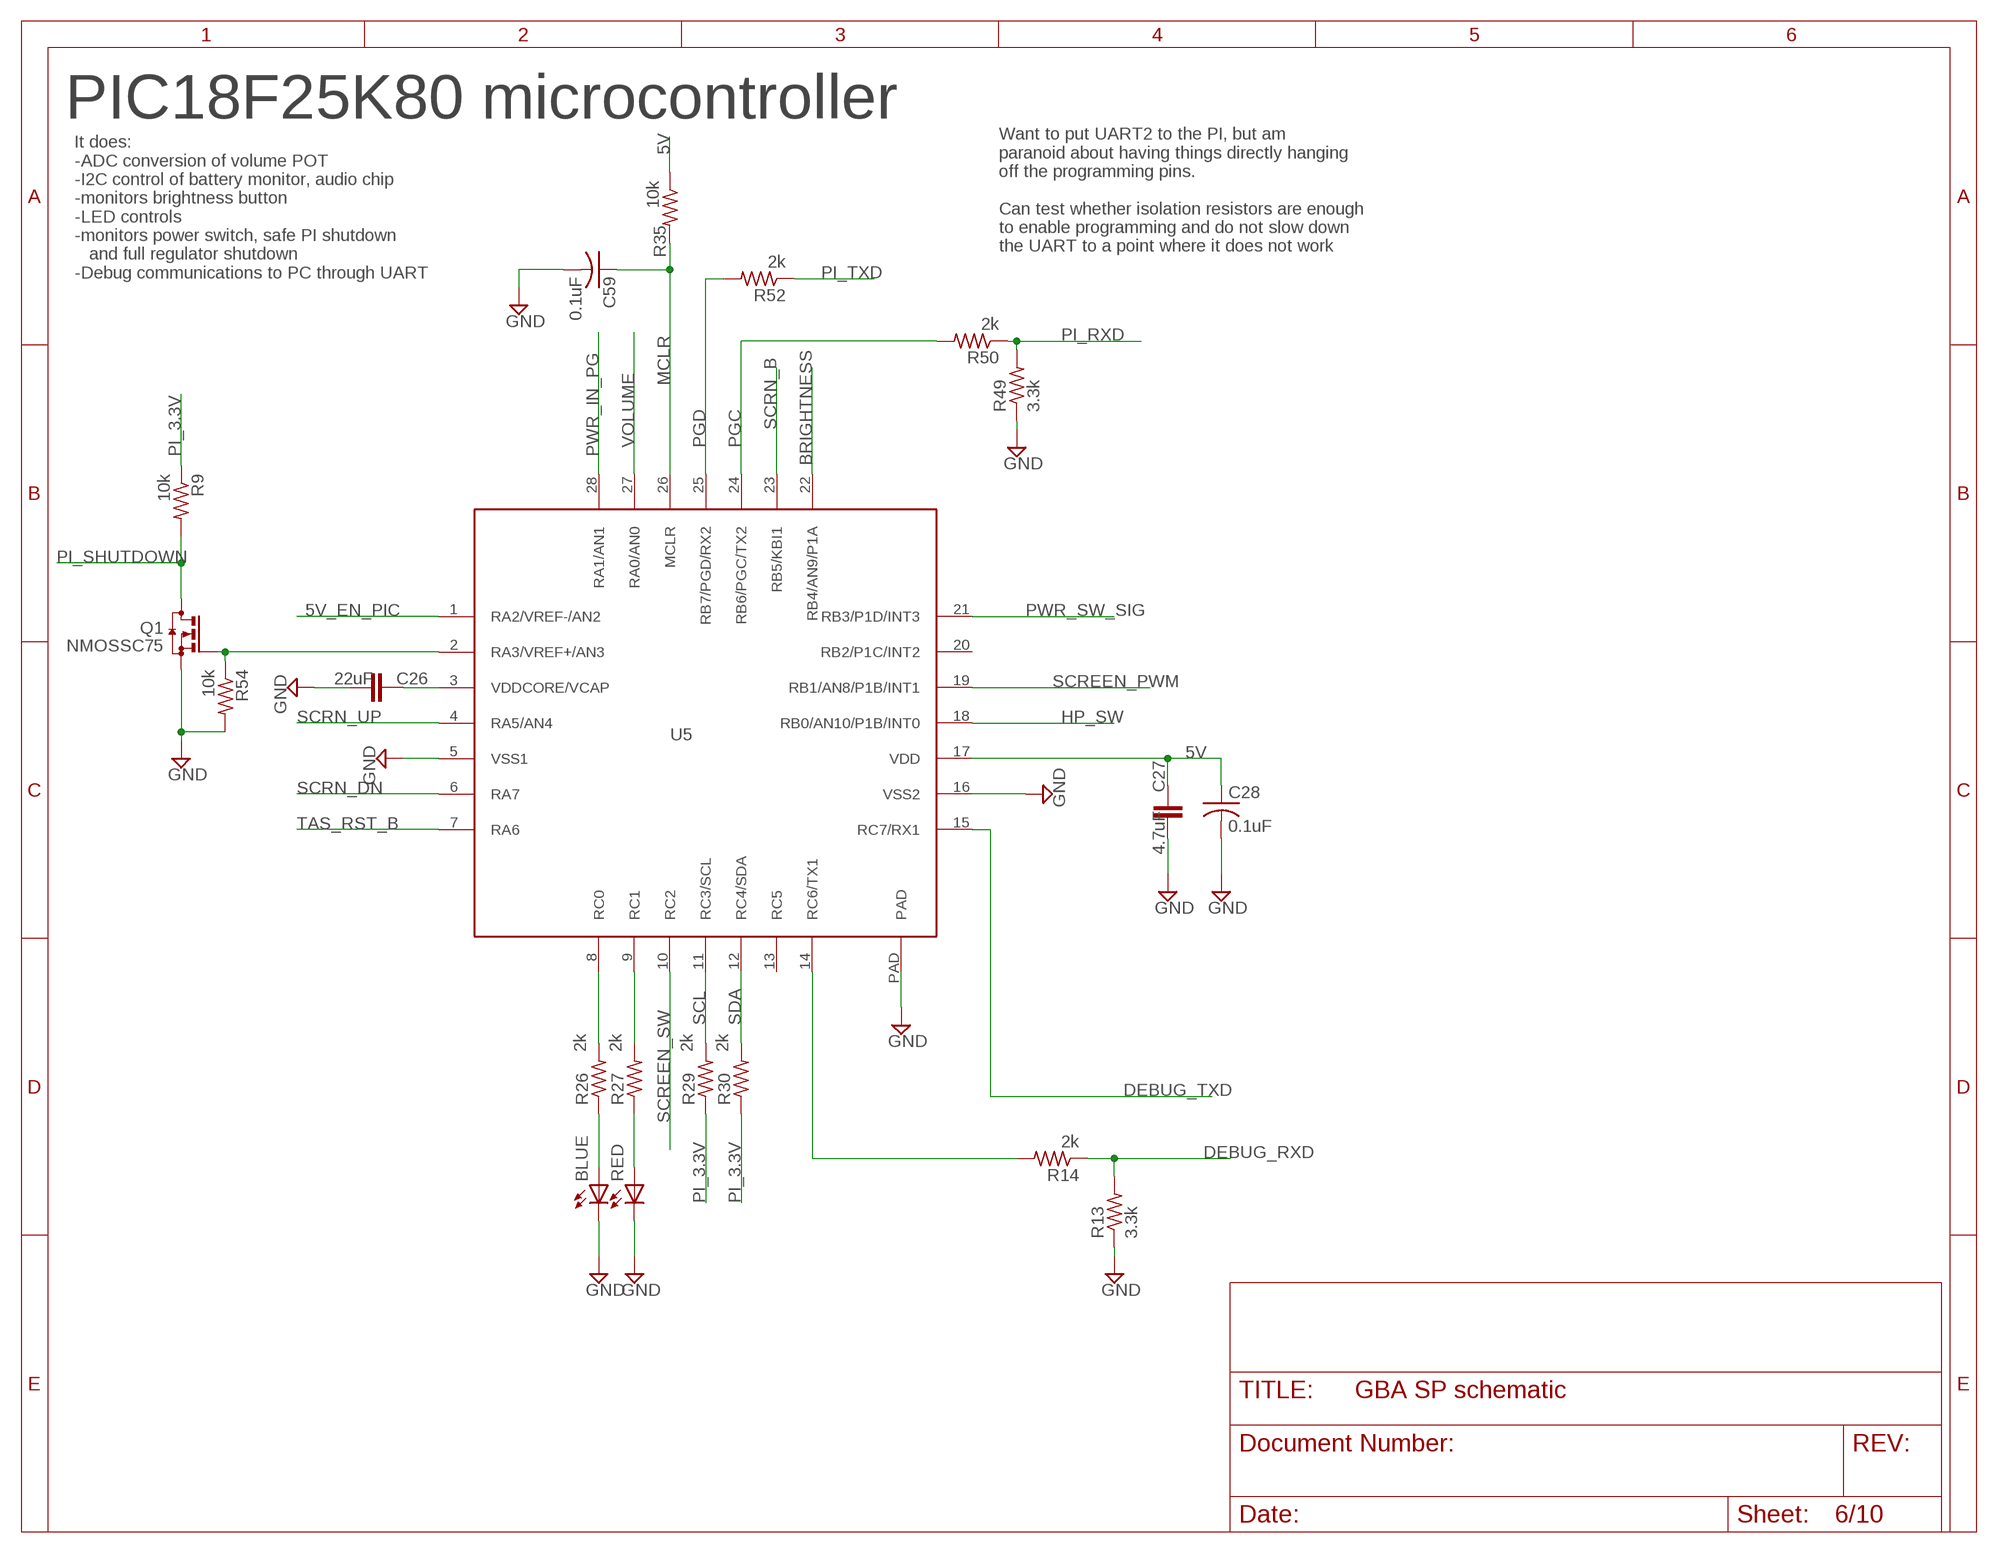
[diagram p5: schematic, sheet 6]

### Parts
BLUE  LEDCHIP-LED0603  [CHIP-LED0603]
C26  22uF  C-EUC0805  [C0805]
C27  4.7uF  C-EUC0603  [C0603]
C28  0.1uF  C-US0402_REAL  [0402_REAL]
C59  0.1uF  C-US0402_REAL  [0402_REAL]
Q1  NMOSSC75  [SC75]
R9  10k  R-US_0402_REAL  [0402_REAL]
R13  3.3k  R-US_0402_REAL  [0402_REAL]
R14  2k  R-US_0402_REAL  [0402_REAL]
R26  2k  R-US_0402_REAL  [0402_REAL]
R27  2k  R-US_0402_REAL  [0402_REAL]
R29  2k  R-US_0402_REAL  [0402_REAL]
R30  2k  R-US_0402_REAL  [0402_REAL]
R35  10k  R-US_0402_REAL  [0402_REAL]
R49  3.3k  R-US_0402_REAL  [0402_REAL]
R50  2k  R-US_0402_REAL  [0402_REAL]
R52  2k  R-US_0402_REAL  [0402_REAL]
R54  10k  R-US_0402_REAL  [0402_REAL]
RED  LEDCHIP-LED0603  [CHIP-LED0603]
U5  PIC18F25K80  [QFN-S_28]

### Nets
5V: C27.1 C28.1 R35.1 U5.17(VDD) ; also sheet 1,2,3,4,5,7,10
5V_EN_PIC: U5.1(RA2/VREF-/AN2) ; also sheet 3
BRIGHTNESS: U5.22(RB4/AN9/P1A) ; also sheet 2
DEBUG_RXD: R13.2 R14.1 ; also sheet 5
DEBUG_TXD: U5.15(RC7/RX1) ; also sheet 5
GND: BLUE.C C26.2 C27.2 C28.2 C59.2 Q1.S R13.1 R49.1 R54.2 RED.C U5.5(VSS1) U5.16(VSS2) U5.PAD ; also sheet 1,2,3,4,5,7,10
HP_SW: U5.18(RB0/AN10/P1B/INT0) ; also sheet 4
MCLR: C59.1 R35.2 U5.26(MCLR) ; also sheet 5
N$17: R14.2 U5.14(RC6/TX1)
N$18: Q1.G R54.1 U5.2(RA3/VREF+/AN3)
N$20: R27.1 RED.A
N$29: BLUE.A R26.1
N$33: R27.2 U5.9(RC1)
N$36: R26.2 U5.8(RC0)
N$37: C26.1 U5.3(VDDCORE/VCAP)
PGC: R50.2 U5.24(RB6/PGC/TX2) ; also sheet 5
PGD: R52.2 U5.25(RB7/PGD/RX2) ; also sheet 5
PI_3.3V: R9.1 R29.1 R30.1 ; also sheet 1,4
PI_RXD: R49.2 R50.1 ; also sheet 1
PI_SHUTDOWN: Q1.D R9.2 ; also sheet 1
PI_TXD: R52.1 ; also sheet 1
PWR_IN_PG: U5.28(RA1/AN1) ; also sheet 3
PWR_SW_SIG: U5.21(RB3/P1D/INT3) ; also sheet 3
SCL: R29.2 U5.11(RC3/SCL) ; also sheet 4,5
SCREEN_PWM: U5.19(RB1/AN8/P1B/INT1) ; also sheet 1
SCREEN_SW: U5.10(RC2) ; also sheet 2
SCRN_B: U5.23(RB5/KBI1) ; also sheet 2
SCRN_DN: U5.6(RA7) ; also sheet 2
SCRN_UP: U5.4(RA5/AN4) ; also sheet 2
SDA: R30.2 U5.12(RC4/SDA) ; also sheet 4,5
TAS_RST_B: U5.7(RA6) ; also sheet 4
VOLUME: U5.27(RA0/AN0) ; also sheet 2
Unconnected: U5.13(RC5) U5.20(RB2/P1C/INT2)

### Notes on the sheet
- PIC18F25K80 microcontroller
- Want to put UART2 to the PI, but am 
  paranoid about having things directly hanging
  off the programming pins.
  
  Can test whether isolation resistors are enough
  to enable programming and do not slow down
  the UART to a point where it does not work
- It does:
  -ADC conversion of volume POT
  -I2C control of battery monitor, audio chip
  -monitors brightness button
  -LED controls
  -monitors power switch, safe PI shutdown
     and full regulator shutdown
  -Debug communications to PC through UART

## Sheet 7 of 10
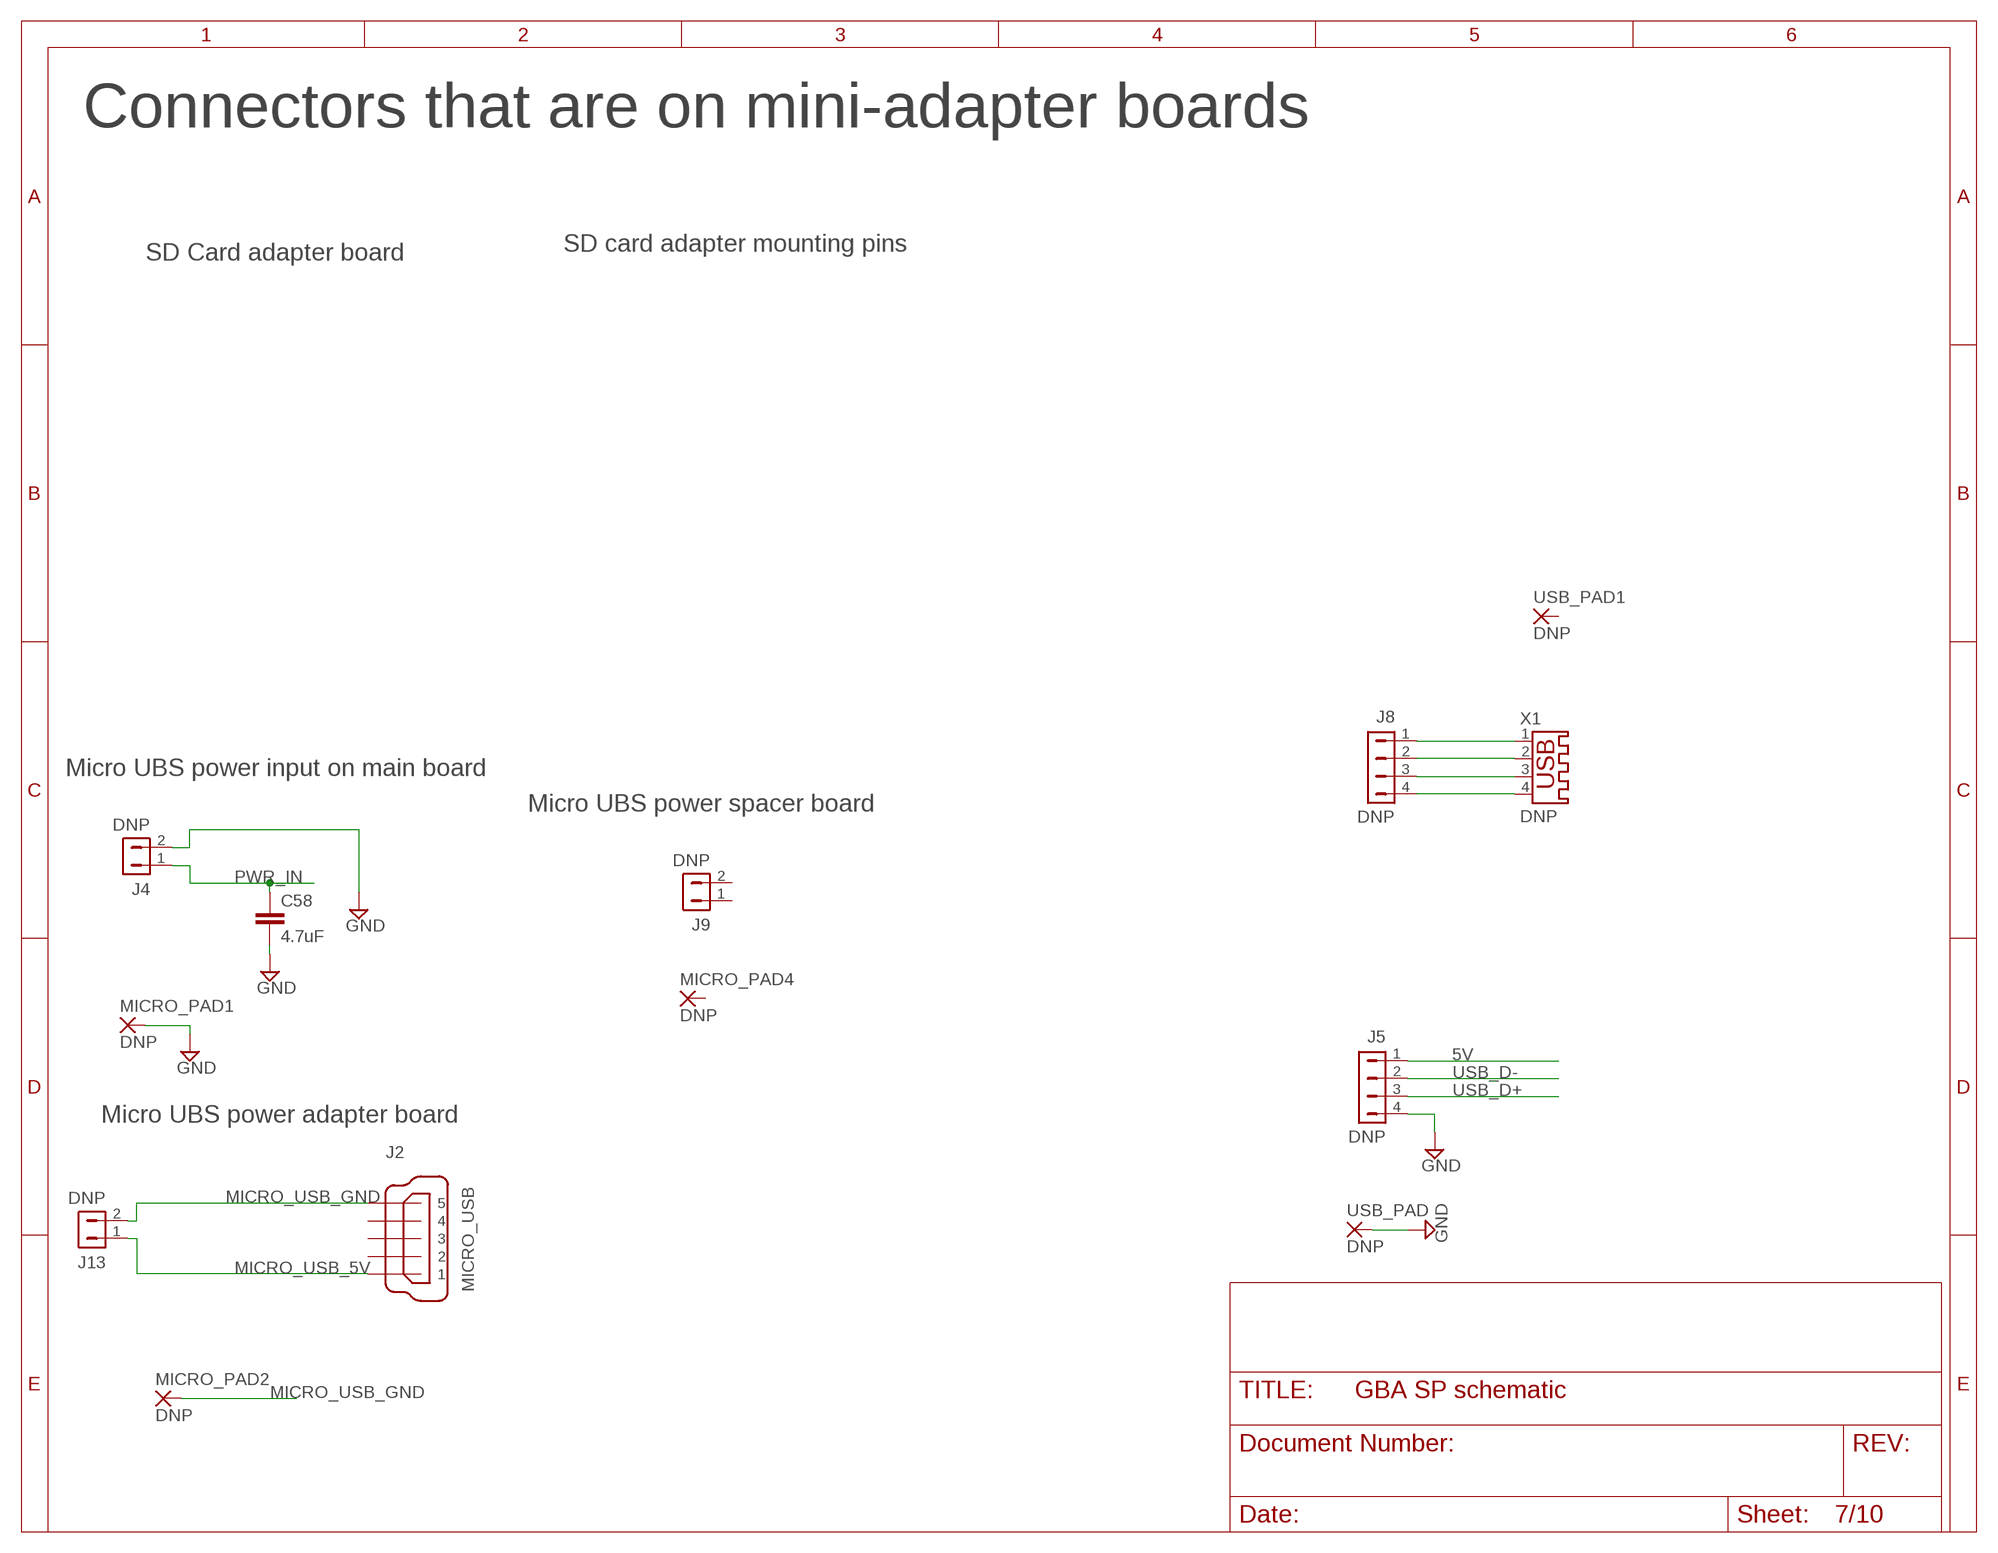
[diagram p6: schematic, sheet 7]

### Parts
C58  4.7uF  C-EUC0603  [C0603]
J2  MICRO_USB  [MICRO_USB]
J4  DNP  DF13-2USB  [USB_PWR_2PIN]
J5  DNP  DF13-4USB  [USB_4PIN]
J8  DNP  DF13-4USB  [USB_4PIN]
J9  DNP  DF13-2USB  [USB_PWR_2PIN]
J13  DNP  DF13-2USB  [USB_PWR_2PIN]
MICRO_PAD1  DNP  1,6/0,8  [1,6/0,8]
MICRO_PAD2  DNP  1,6/0,8  [1,6/0,8]
MICRO_PAD4  DNP  1,6/0,8  [1,6/0,8]
USB_PAD  DNP  1,6/0,8  [1,6/0,8]
USB_PAD1  DNP  1,6/0,8  [1,6/0,8]
X1  DNP  USB-A003  [USB-A003]

### Nets
5V: J5.1 ; also sheet 1,2,3,4,5,6,10
GND: C58.2 J4.2 J5.4 MICRO_PAD1.1(P) USB_PAD.1(P) ; also sheet 1,2,3,4,5,6,10
MICRO_USB_5V: J2.1 J13.1
MICRO_USB_GND: J2.5 J13.2 MICRO_PAD2.1(P)
N$31: J8.1 X1.1
N$38: J8.2 X1.2
N$41: J8.3 X1.3
N$42: J8.4 X1.4
PWR_IN: C58.1 J4.1 ; also sheet 2,3,5
USB_D+: J5.3 ; also sheet 1
USB_D-: J5.2 ; also sheet 1
Unconnected: J2.2 J2.3 J2.4 J9.1 J9.2 MICRO_PAD4.1(P) USB_PAD1.1(P)

### Notes on the sheet
- Connectors that are on mini-adapter boards
- SD card adapter mounting pins
- SD Card adapter board
- Micro UBS power input on main board
- Micro UBS power spacer board
- Micro UBS power adapter board

## Sheet 8 of 10
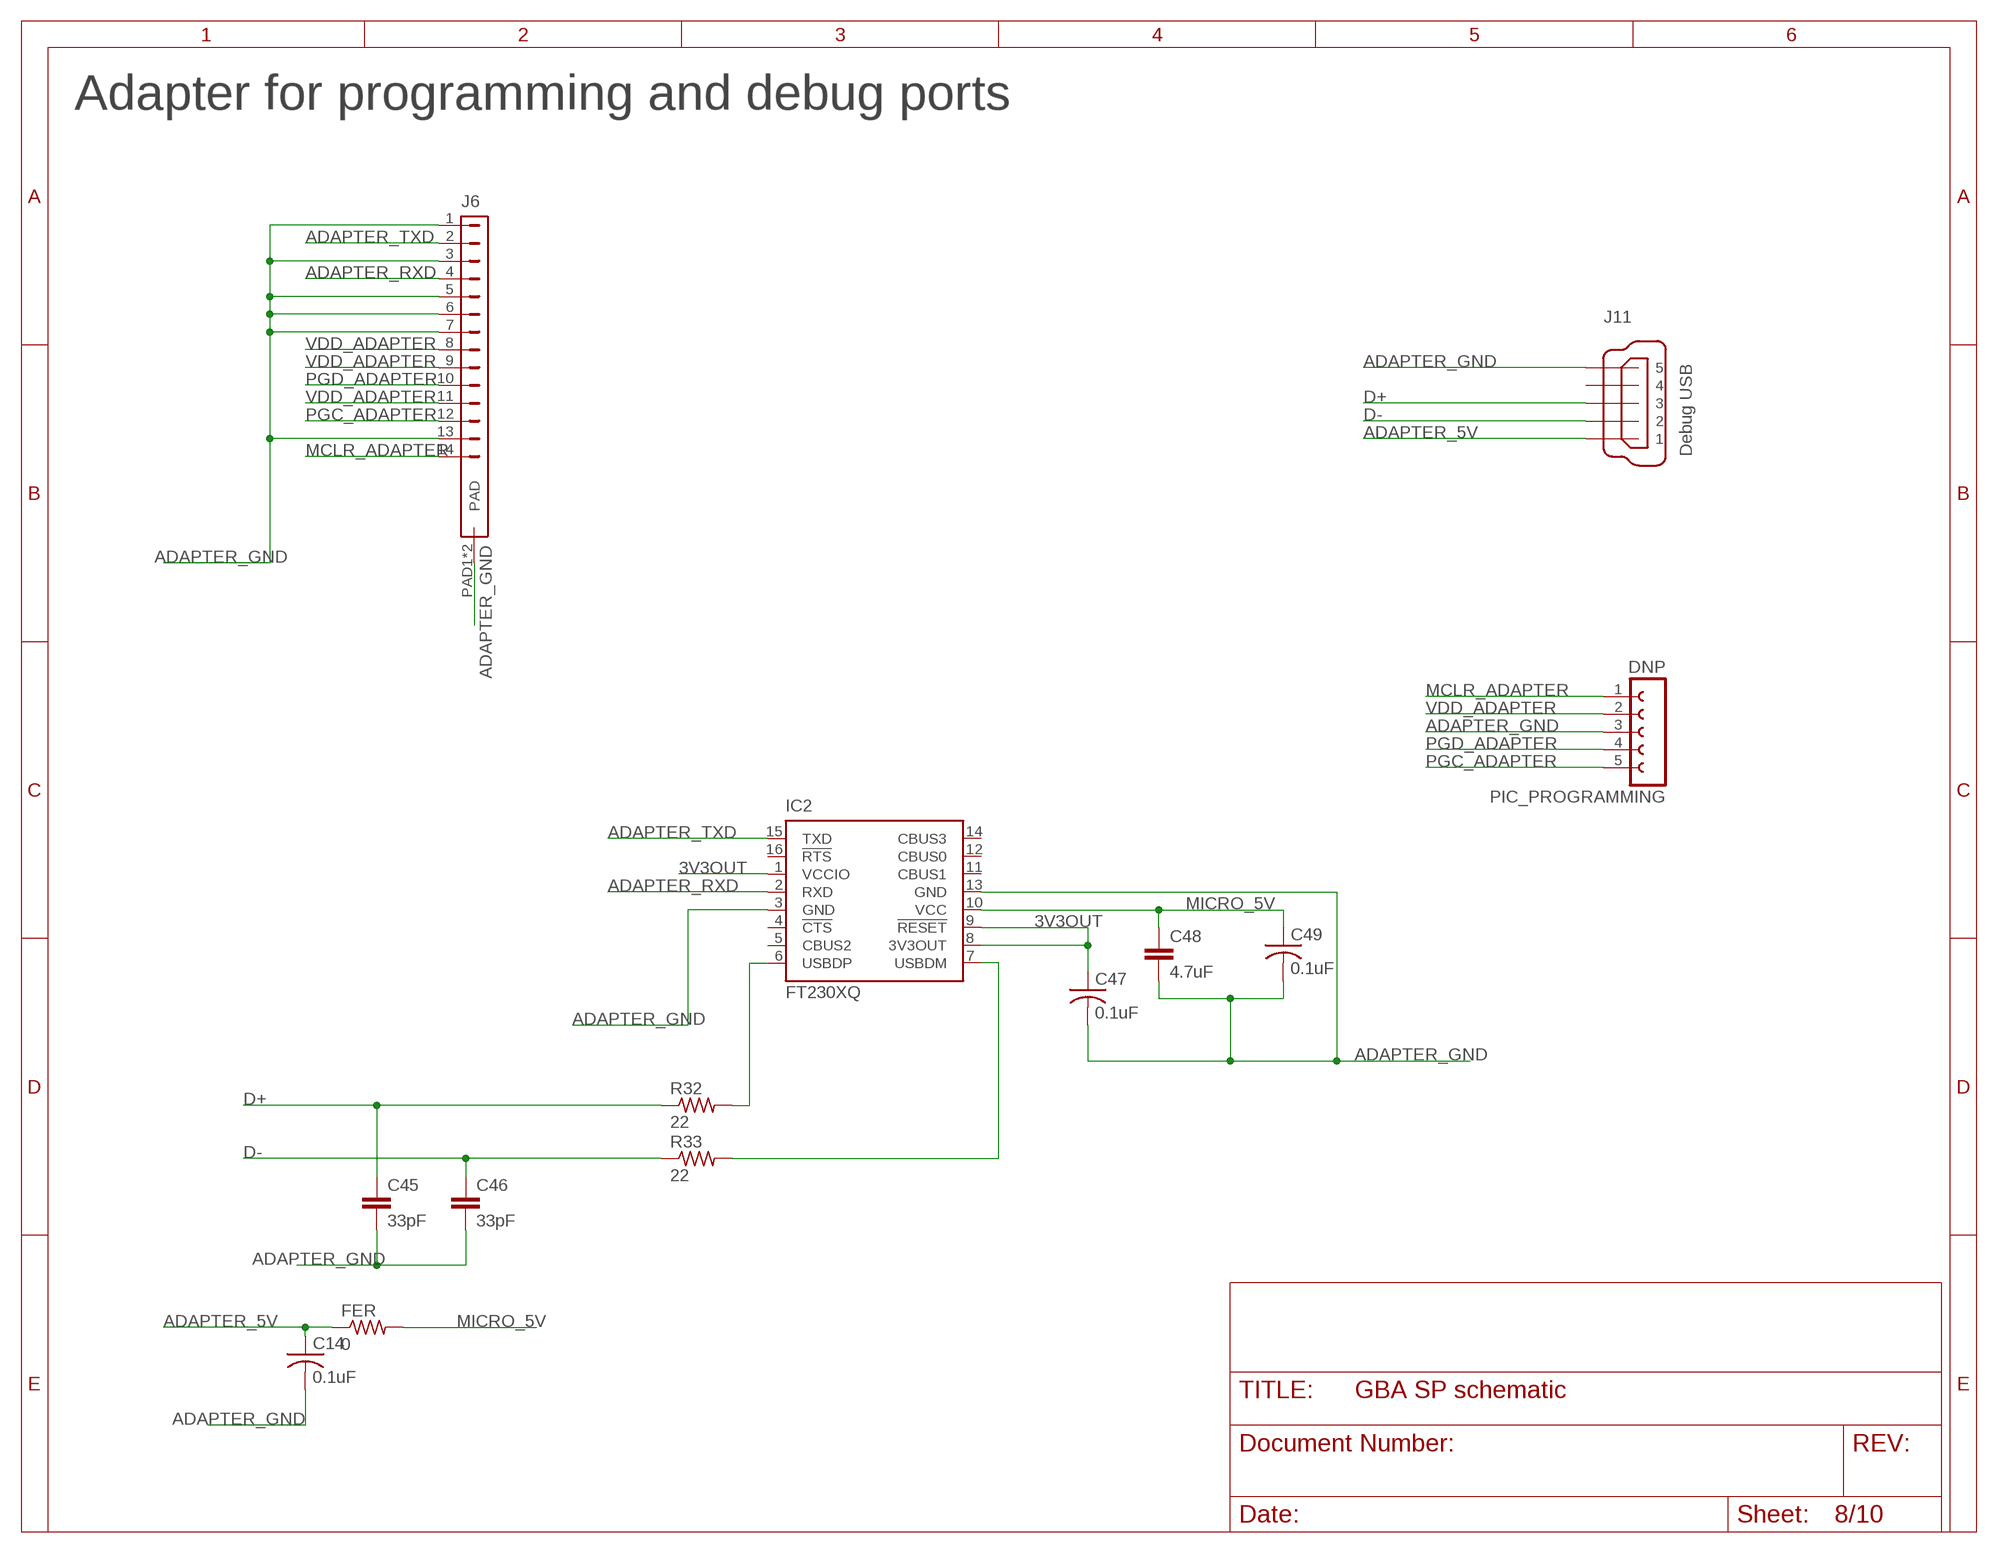
[diagram p7: schematic, sheet 8]

### Parts
C14  0.1uF  C-US0402_REAL  [0402_REAL]
C45  33pF  C-EU0402_REAL  [0402_REAL]
C46  33pF  C-EU0402_REAL  [0402_REAL]
C47  0.1uF  C-US0402_REAL  [0402_REAL]
C48  4.7uF  C-EUC0603  [C0603]
C49  0.1uF  C-US0402_REAL  [0402_REAL]
FER  0  R-US_R0603  [R0603]
IC2  FT230XQ  [QFN16]
J6  FPC_14  [FPC_14]
J11  Debug USB  MICRO_USB  [MICRO_USB]
PIC_PROGRAMMING  DNP  FE05-1  [FE05-1]
R32  22  R-US_0402_REAL  [0402_REAL]
R33  22  R-US_0402_REAL  [0402_REAL]

### Nets
3V3OUT: C47.1 IC2.1(VCCIO) IC2.8(3V3OUT) IC2.9(!RESET)
ADAPTER_5V: C14.1 FER.1 J11.1
ADAPTER_GND: C14.2 C45.2 C46.2 C47.2 C48.2 C49.2 IC2.3(GND) IC2.13(GND) J6.1 J6.3 J6.5 J6.6 J6.7 J6.13 J6.PAD1(PAD) J6.PAD2(PAD) J11.5 PIC_PROGRAMMING.3
ADAPTER_RXD: IC2.2(RXD) J6.4
ADAPTER_TXD: IC2.15(TXD) J6.2
D+: C45.1 J11.3 R32.1
D-: C46.1 J11.2 R33.1
DM: IC2.7(USBDM) R33.2
DP: IC2.6(USBDP) R32.2
MCLR_ADAPTER: J6.14 PIC_PROGRAMMING.1
MICRO_5V: C48.1 C49.1 FER.2 IC2.10(VCC)
PGC_ADAPTER: J6.12 PIC_PROGRAMMING.5
PGD_ADAPTER: J6.10 PIC_PROGRAMMING.4
VDD_ADAPTER: J6.8 J6.9 J6.11 PIC_PROGRAMMING.2
Unconnected: IC2.4(!CTS) IC2.5(CBUS2) IC2.11(CBUS1) IC2.12(CBUS0) IC2.14(CBUS3) IC2.16(!RTS) J11.4

### Notes on the sheet
- Adapter for programming and debug ports

## Sheet 9 of 10
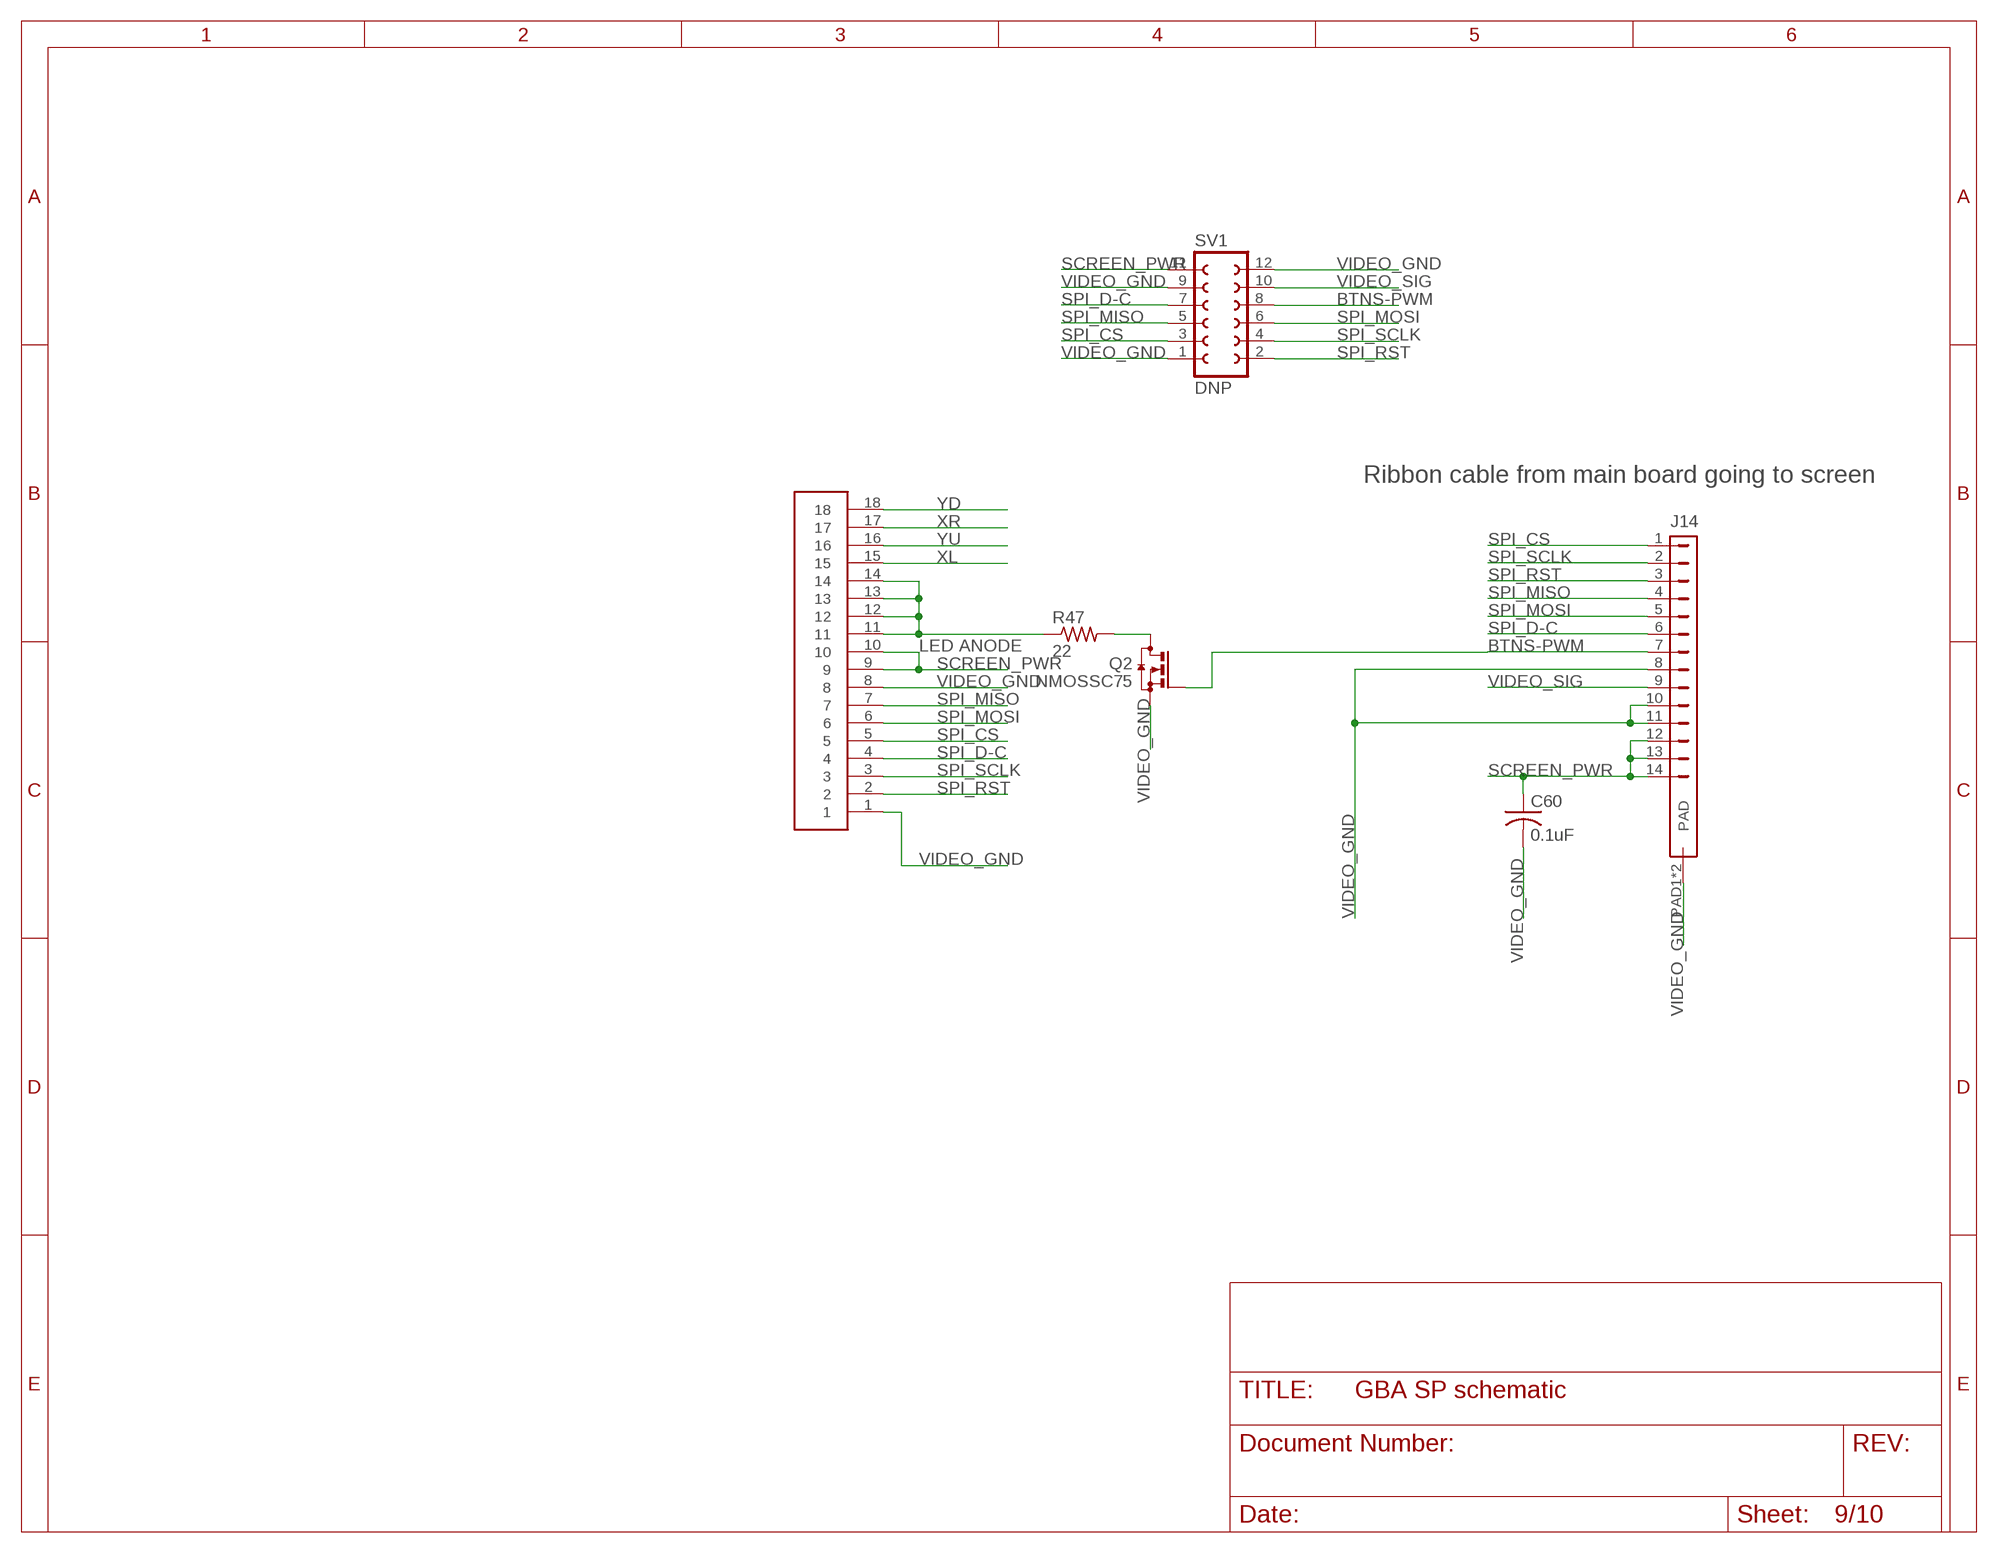
[diagram p8: schematic, sheet 9]

### Parts
C60  0.1uF  C-US0402_REAL  [0402_REAL]
J14  FPC_14  [FPC_14]
Q2  NMOSSC75  [SC75]
R47  22  R-US_0402_REAL  [0402_REAL]
SCREEN1  DNP  SPI_SCREEN  [SPI_SCREEN]
SV1  DNP  FE06-2  [FE06-2]

### Nets
BTNS-PWM: J14.7 Q2.G SV1.8
K: R47.1 SCREEN1.11 SCREEN1.12 SCREEN1.13 SCREEN1.14
N$44: Q2.D R47.2
SCREEN_PWR: C60.1 J14.12 J14.13 J14.14 SCREEN1.9 SCREEN1.10 SV1.11
SPI_CS: J14.1 SCREEN1.5 SV1.3
SPI_D-C: J14.6 SCREEN1.4 SV1.7
SPI_MISO: J14.4 SCREEN1.7 SV1.5
SPI_MOSI: J14.5 SCREEN1.6 SV1.6
SPI_RST: J14.3 SCREEN1.2 SV1.2
SPI_SCLK: J14.2 SCREEN1.3 SV1.4
VIDEO_GND: C60.2 J14.8 J14.10 J14.11 J14.PAD1(PAD) J14.PAD2(PAD) Q2.S SCREEN1.1 SCREEN1.8 SV1.1 SV1.9 SV1.12
VIDEO_SIG: J14.9 SV1.10
XL: SCREEN1.15
XR: SCREEN1.17
YD: SCREEN1.18
YU: SCREEN1.16

### Notes on the sheet
- Ribbon cable from main board going to screen
- LED ANODE

## Sheet 10 of 10
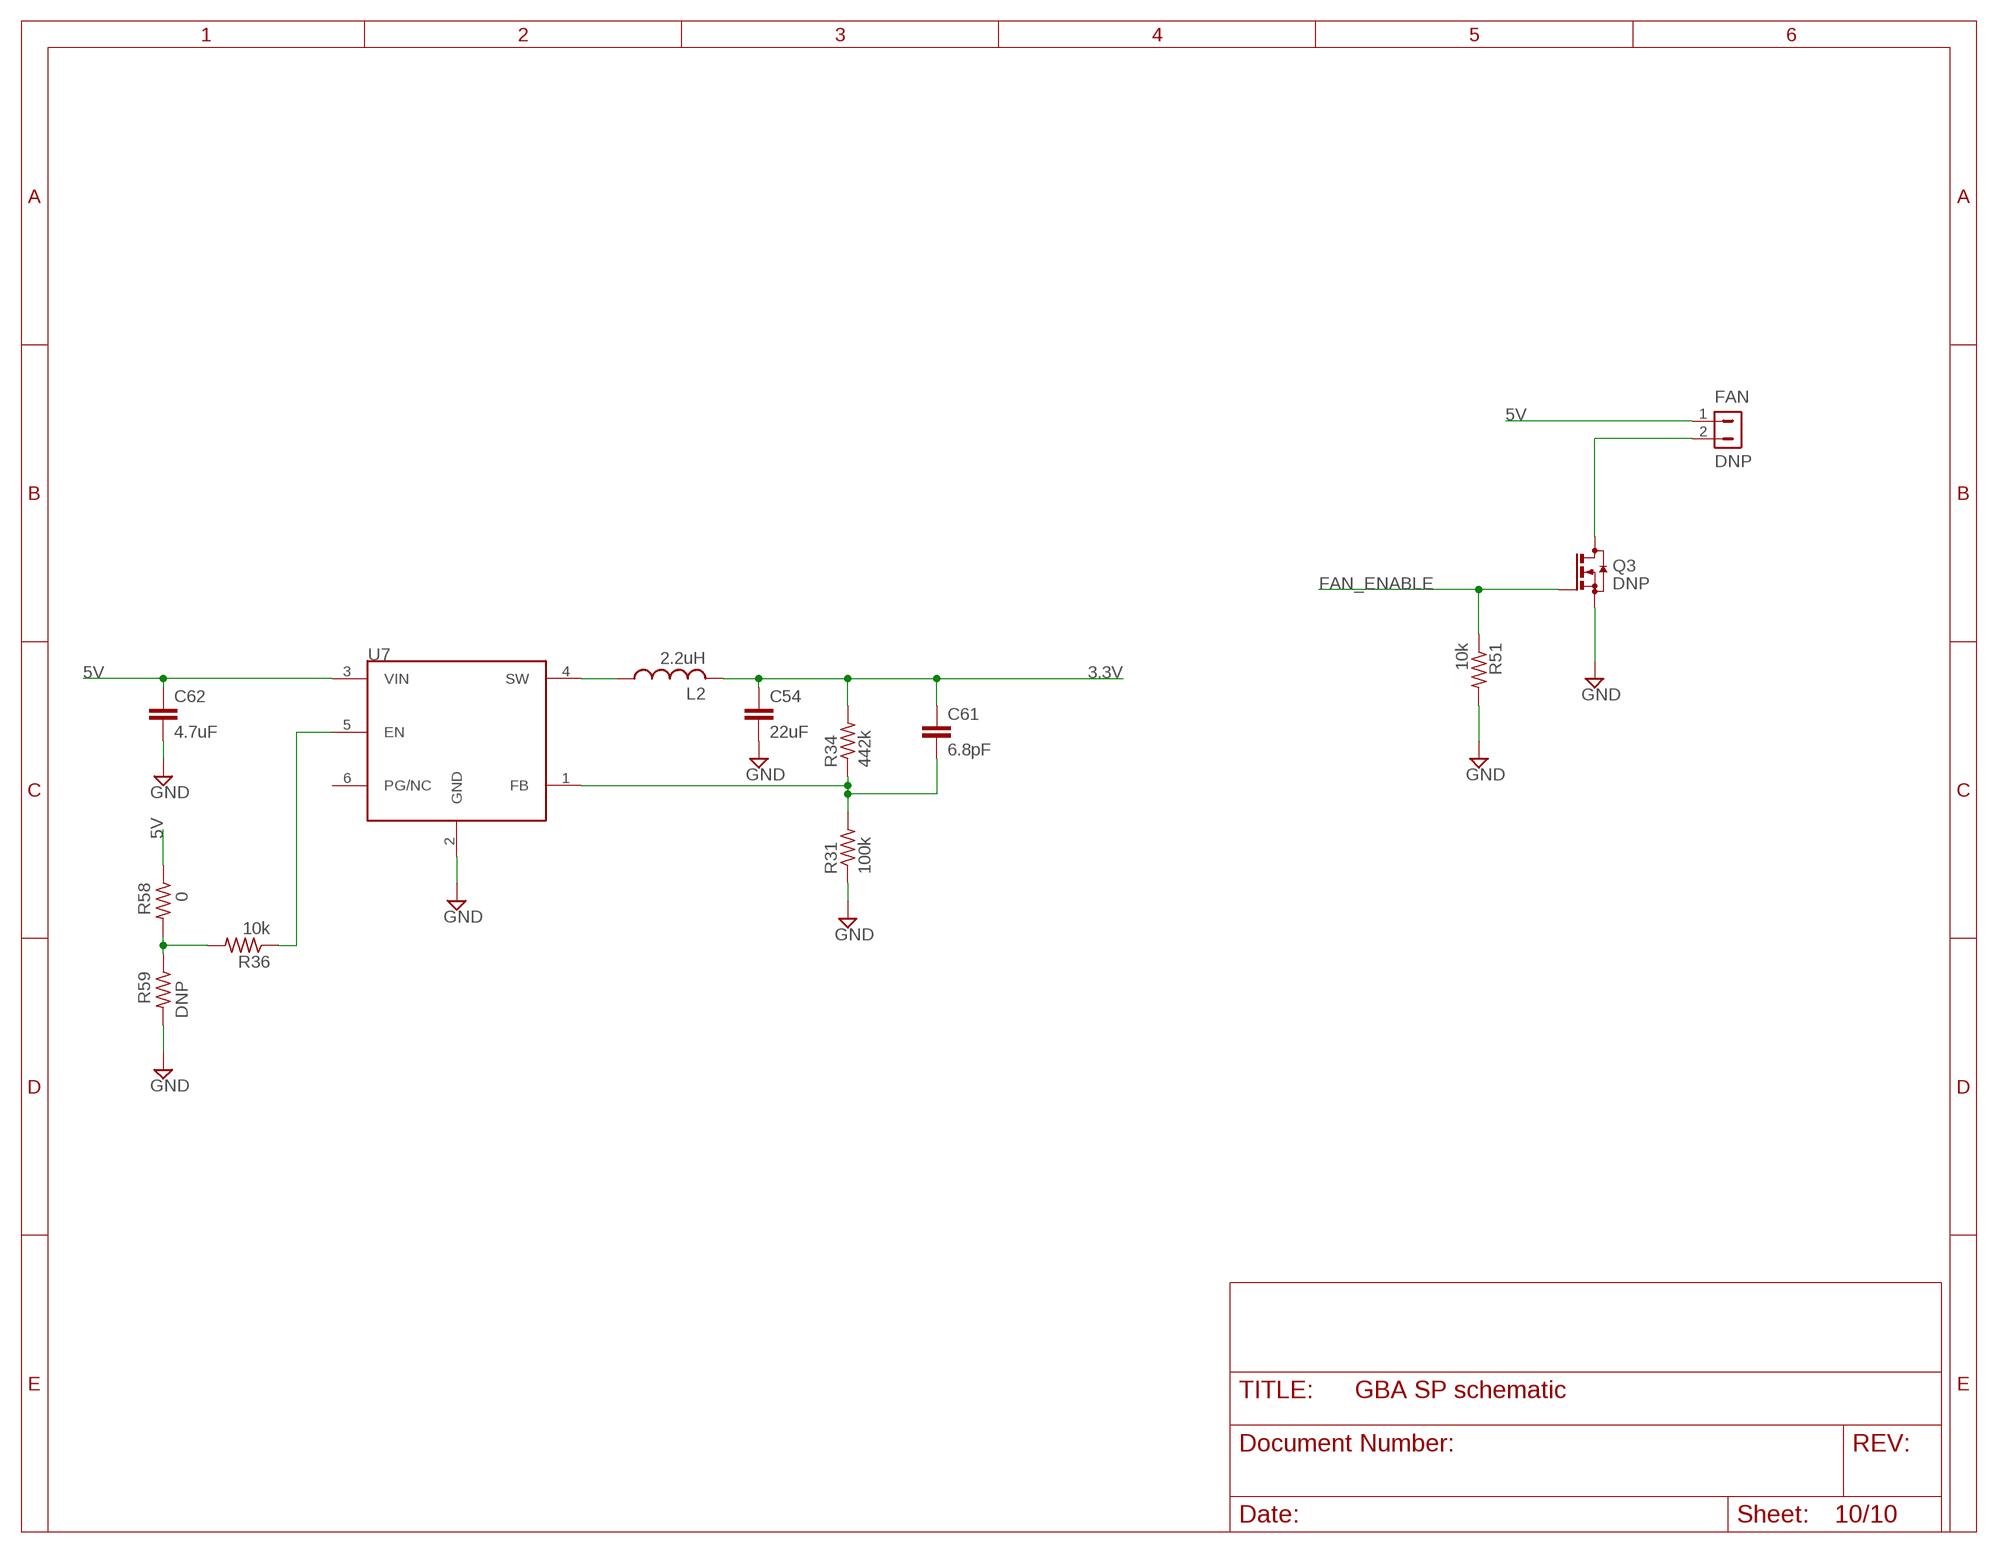
[diagram p9: schematic, sheet 10]

### Parts
C54  22uF  C-EUC0805  [C0805]
C61  6.8pF  C-EU0402_REAL  [0402_REAL]
C62  4.7uF  C-EUC0603  [C0603]
FAN  DNP  HEADER-1X2  [HEADER-1X2]
L2  2.2uH  INDUCTOR_2P2UH  [L2520]
Q3  DNP  DMG6402  [TSOT23-6]
R31  100k  R-US_0402_REAL  [0402_REAL]
R34  442k  R-US_0402_REAL  [0402_REAL]
R36  10k  R-US_0402_REAL  [0402_REAL]
R51  10k  R-US_0402_REAL  [0402_REAL]
R58  0  R-US_0402_REAL  [0402_REAL]
R59  DNP  R-US_0402_REAL  [0402_REAL]
U7  TLV62568  [SOT-563]

### Nets
3.3V: C54.1 C61.1 L2.2 R34.2 ; also sheet 1
3.3V_EN: R36.1 U7.5(EN)
5V: C62.1 FAN.1 R58.1 U7.3(VIN) ; also sheet 1,2,3,4,5,6,7
FAN_ENABLE: Q3.3(G) R51.1 ; also sheet 1
GND: C54.2 C62.2 Q3.4(S) R31.1 R51.2 R59.2 U7.2(GND) ; also sheet 1,2,3,4,5,6,7
N$24: R36.2 R58.2 R59.1
N$39: L2.1 U7.4(SW)
N$45: C61.2 R31.2 R34.1 U7.1(FB)
N$49: FAN.2 Q3.1(D) Q3.2(D) Q3.5(D) Q3.6(D)
Unconnected: U7.6(PG/NC)

## Library data of the parts
A B DOWN LEFT RIGHT UP X Y = Custom_Library:TACTILE; MF: ALPS; MOUSER: 688-SKRRAA; MPN: SKRRAAE010
BATT FAN = Custom_Library:HEADER-1X2
BLUE = led:LED: LED OSRAM: - CHIPLED LG R971, LG N971, LY N971, LG Q971, LY Q971, LO R971, LY R971 LH N974, LH R974 LS Q976, LO Q976, LY Q976 LO Q996 - Hyper CHIPLED LW Q18S LB Q993, LB Q99A, LB R99A - SideLED LS A670, LO A670, LY A670, LG A670, LP A670 LB A673, LV A673, LT A673, LW A673 LH A674 LY A675 LS A676, LA A676, LO A676, LY A676, LW A676 LS A679, LY A679, LG A679 - Hyper Micro SIDELED® LS Y876, LA Y876, LO Y876, LY Y876 LT Y87S - SmartLED LW L88C, LW L88S LB L89C, LB L89S, LG L890 LS L89K, LO L89K, LY L89K LS L896, LA L896, LO L896, LY L896 - TOPLED LS T670, LO T670, LY T670, LG T670, LP T670 LSG T670, LSP T670, LSY T670, LOP T670, LYG T670 LG T671, LOG T671, LSG T671 LB T673, LV T673, LT T673, LW T673 LH T674 LS T676, LA T676, LO T676, LY T676, LB T676, LH T676, LSB T676, LW T676 LB T67C, LV T67C, LT T67C, LS T67K, LO T67K, LY T67K, LW E67C LS E67B, LA E67B, LO E67B, LY E67B, LB E67C, LV E67C, LT E67C LW T67C LS T679, LY T679, LG T679 LS T770, LO T770, LY T770, LG T770, LP T770 LB T773, LV T773, LT T773, LW T773 LH T774 LS E675, LA E675, LY E675, LS T675 LS T776, LA T776, LO T776, LY T776, LB T776 LHGB T686 LT T68C, LB T68C - Hyper Mini TOPLED® LB M676 - Mini TOPLED Santana® LG M470 LS M47K, LO M47K, LY M47K Source: http://www.osram.convergy.de LUXEON: - LUMILED® LXK2-PW12-R00, LXK2-PW12-S00, LXK2-PW14-U00, LXK2-PW14-V00 LXK2-PM12-R00, LXK2-PM12-S00, LXK2-PM14-U00 LXK2-PE12-Q00, LXK2-PE12-R00, LXK2-PE12-S00, LXK2-PE14-T00, LXK2-PE14-U00 LXK2-PB12-K00, LXK2-PB12-L00, LXK2-PB12-M00, LXK2-PB14-N00, LXK2-PB14-P00, LXK2-PB14-Q00 LXK2-PR12-L00, LXK2-PR12-M00, LXK2-PR14-Q00, LXK2-PR14-R00 LXK2-PD12-Q00, LXK2-PD12-R00, LXK2-PD12-S00 LXK2-PH12-R00, LXK2-PH12-S00 LXK2-PL12-P00, LXK2-PL12-Q00, LXK2-PL12-R00 Source: www.luxeon.com KINGBRIGHT: KA-3528ASYC Source: www.kingbright.com; DIGIKEY: 160-1827-1-ND; MF: Lite-On; MPN: LTST-C193TBKT-5A
BRIGHTNESS SELECT START = Custom_Library:TACTILE; DIGIKEY: EG4621CT-ND; MF: E-switch; MPN: TL3315NF160Q
C1 C3-C5 C19-C21 C23 C26 C53 C54 = rcl:C-EU: CAPACITOR, European symbol; DIGIKEY: 587-5464-1-ND; MF: Taiyo Yuden; MPN: LMK212BBJ226MG-T
C2 C6 C11 C13 C14 C16-C18 C22 C24 C25 C28-C44 C47 C49 C50 C52 C55 C59 C60 = rcl:C-US: CAPACITOR, American symbol; DIGIKEY: 311-1343-1-ND; MF: Yageo; MPN: CC0603ZRY5V9BB104
C7 = rcl:C-US: CAPACITOR, American symbol; DIGIKEY: 490-4516-1-ND; MF: Murata; MPN: GRM155R71H103KA88D
C8-C10 C12 C27 C48 C58 C62 = rcl:C-EU: CAPACITOR, European symbol; DIGIKEY: 311-1455-1-ND; MF: Yageo; MPN: CC0603KRX5R6BB475
C15 C51 = rcl:C-EU: CAPACITOR, European symbol; DIGIKEY: 490-9961-1-ND; MF: Murata; MPN: GRM21BR61A476ME15L
C45 C46 C63 = rcl:C-EU: CAPACITOR, European symbol
C61 = rcl:C-EU: CAPACITOR, European symbol; DIGIKEY: 311-1637-1-ND; MF: Yageo; MPN: CC0402DRNPO9BN6R8
D1 D2 = diode:BAS70-05: Silicon Schottky Diodes General-purpose diode for high-speed switching; DIGIKEY: BAS70-05-E3-08CT-ND; MF: Vishay; MPN: BAS70-05-E3-08
D6 = diode:DIODE-: DIODE
FER R1 R9 R12 R13 R15-R20 R22 R24 R28 R32 R33 R35-R39 R41-R49 R51 R53 R54 R56-R64 RTHERM = rcl:R-US_: RESISTOR, American symbol
GREEN = led:LED: LED OSRAM: - CHIPLED LG R971, LG N971, LY N971, LG Q971, LY Q971, LO R971, LY R971 LH N974, LH R974 LS Q976, LO Q976, LY Q976 LO Q996 - Hyper CHIPLED LW Q18S LB Q993, LB Q99A, LB R99A - SideLED LS A670, LO A670, LY A670, LG A670, LP A670 LB A673, LV A673, LT A673, LW A673 LH A674 LY A675 LS A676, LA A676, LO A676, LY A676, LW A676 LS A679, LY A679, LG A679 - Hyper Micro SIDELED® LS Y876, LA Y876, LO Y876, LY Y876 LT Y87S - SmartLED LW L88C, LW L88S LB L89C, LB L89S, LG L890 LS L89K, LO L89K, LY L89K LS L896, LA L896, LO L896, LY L896 - TOPLED LS T670, LO T670, LY T670, LG T670, LP T670 LSG T670, LSP T670, LSY T670, LOP T670, LYG T670 LG T671, LOG T671, LSG T671 LB T673, LV T673, LT T673, LW T673 LH T674 LS T676, LA T676, LO T676, LY T676, LB T676, LH T676, LSB T676, LW T676 LB T67C, LV T67C, LT T67C, LS T67K, LO T67K, LY T67K, LW E67C LS E67B, LA E67B, LO E67B, LY E67B, LB E67C, LV E67C, LT E67C LW T67C LS T679, LY T679, LG T679 LS T770, LO T770, LY T770, LG T770, LP T770 LB T773, LV T773, LT T773, LW T773 LH T774 LS E675, LA E675, LY E675, LS T675 LS T776, LA T776, LO T776, LY T776, LB T776 LHGB T686 LT T68C, LB T68C - Hyper Mini TOPLED® LB M676 - Mini TOPLED Santana® LG M470 LS M47K, LO M47K, LY M47K Source: http://www.osram.convergy.de LUXEON: - LUMILED® LXK2-PW12-R00, LXK2-PW12-S00, LXK2-PW14-U00, LXK2-PW14-V00 LXK2-PM12-R00, LXK2-PM12-S00, LXK2-PM14-U00 LXK2-PE12-Q00, LXK2-PE12-R00, LXK2-PE12-S00, LXK2-PE14-T00, LXK2-PE14-U00 LXK2-PB12-K00, LXK2-PB12-L00, LXK2-PB12-M00, LXK2-PB14-N00, LXK2-PB14-P00, LXK2-PB14-Q00 LXK2-PR12-L00, LXK2-PR12-M00, LXK2-PR14-Q00, LXK2-PR14-R00 LXK2-PD12-Q00, LXK2-PD12-R00, LXK2-PD12-S00 LXK2-PH12-R00, LXK2-PH12-S00 LXK2-PL12-P00, LXK2-PL12-Q00, LXK2-PL12-R00 Source: www.luxeon.com KINGBRIGHT: KA-3528ASYC Source: www.kingbright.com; DIGIKEY: 160-1446-1-ND; MF: Lite-On; MPN: LTST-C191KGKT
IC2 = ftdichip:FT230X: USB to BASIC UART IC Auto generated by make-symbol-device-package-bsdl.ulp Rev. 43 Source: Data sheet <http://www.ftdichip.com/Support/Documents/DataSheets/ICs/DS_FT230X.pdf>; DIGIKEY: 768-1130-1-ND; MF: FTDI; MPN: FT230XQ-R
J1 = Custom_Library:HEADPHONE_JACK; DIGIKEY: CP-3524SJCT-ND; MF: CUI; MPN: SJ-3524-SMT
J2 J11 = Custom_Library:MICRO_USB; DIGIKEY: 609-4613-1-ND; MF: Amphenol; MPN: 10118192-0001LF
J4 J9 J13 THERM = Custom_Library:DF13-2
J5 J8 = Custom_Library:DF13-4
J6 J7 J12 J14 = Custom_Library:FPC_14; DIGIKEY: WM12370CT-ND; MF: Molex; MPN: 5051101492
L1 = Custom_Library:XFL4020-102MEB; MF: Wurth Electronics; MPN: 74405042010
L2 = Custom_Library:INDUCTOR_2P2UH; DIGIKEY: 490-5114-2-ND; MF: Murata; MPN: LQM2HPN2R2MG0L
MICRO_PAD1 MICRO_PAD2 MICRO_PAD4 USB_PAD USB_PAD1 = wirepad:1,6/0,8: THROUGH-HOLE PAD
PI1 = Custom_Library:PI-ZERO
PIC_PROGRAMMING = con-lsta:FE05-1: FEMALE HEADER; DIGIKEY: S5441-ND; MF: Sullins Connector Solutions; MPN: PPTC051LGBN-RC; OC_FARNELL: unknown; OC_NEWARK: unknown
Q1 Q2 = Custom_Library:NMOS; DIGIKEY: NTA4001NT1GOSCT-ND; MF: ON Semi; MPN: NTA4001NT1G
Q3 = Custom_Library:DMG6402; DIGIKEY: FDC637BNZCT-ND; MF: Fairchild; MPN: FDC637BNZ
Q4 = Custom_Library:PMOS
R2 = rcl:R-US_: RESISTOR, American symbol; DIGIKEY: YAG3151CT-ND; MF: Yageo; MPN: RC0402FR-07402KL
R3-R5 R8 R10 R11 R31 R55 = rcl:R-US_: RESISTOR, American symbol; DIGIKEY: 311-100KLRCT-ND; MF: Yageo; MPN: RC0402FR-07100KL
R6 = rcl:R-US_: RESISTOR, American symbol; DIGIKEY: 311-270KJRCT-ND; MF: Yageo; MPN: RC0402JR-07270KL
R7 R14 R21 R23 R25-R27 R29 R30 R40 R50 R52 = rcl:R-US_: RESISTOR, American symbol; DIGIKEY: P2.00KLCT-ND; MF: Panasonic; MPN: ERJ-2RKF2001X
R34 = rcl:R-US_: RESISTOR, American symbol; DIGIKEY: 311-442KLRCT-ND; MF: Yageo; MPN: RC0402FR-07442KL
RED = led:LED: LED OSRAM: - CHIPLED LG R971, LG N971, LY N971, LG Q971, LY Q971, LO R971, LY R971 LH N974, LH R974 LS Q976, LO Q976, LY Q976 LO Q996 - Hyper CHIPLED LW Q18S LB Q993, LB Q99A, LB R99A - SideLED LS A670, LO A670, LY A670, LG A670, LP A670 LB A673, LV A673, LT A673, LW A673 LH A674 LY A675 LS A676, LA A676, LO A676, LY A676, LW A676 LS A679, LY A679, LG A679 - Hyper Micro SIDELED® LS Y876, LA Y876, LO Y876, LY Y876 LT Y87S - SmartLED LW L88C, LW L88S LB L89C, LB L89S, LG L890 LS L89K, LO L89K, LY L89K LS L896, LA L896, LO L896, LY L896 - TOPLED LS T670, LO T670, LY T670, LG T670, LP T670 LSG T670, LSP T670, LSY T670, LOP T670, LYG T670 LG T671, LOG T671, LSG T671 LB T673, LV T673, LT T673, LW T673 LH T674 LS T676, LA T676, LO T676, LY T676, LB T676, LH T676, LSB T676, LW T676 LB T67C, LV T67C, LT T67C, LS T67K, LO T67K, LY T67K, LW E67C LS E67B, LA E67B, LO E67B, LY E67B, LB E67C, LV E67C, LT E67C LW T67C LS T679, LY T679, LG T679 LS T770, LO T770, LY T770, LG T770, LP T770 LB T773, LV T773, LT T773, LW T773 LH T774 LS E675, LA E675, LY E675, LS T675 LS T776, LA T776, LO T776, LY T776, LB T776 LHGB T686 LT T68C, LB T68C - Hyper Mini TOPLED® LB M676 - Mini TOPLED Santana® LG M470 LS M47K, LO M47K, LY M47K Source: http://www.osram.convergy.de LUXEON: - LUMILED® LXK2-PW12-R00, LXK2-PW12-S00, LXK2-PW14-U00, LXK2-PW14-V00 LXK2-PM12-R00, LXK2-PM12-S00, LXK2-PM14-U00 LXK2-PE12-Q00, LXK2-PE12-R00, LXK2-PE12-S00, LXK2-PE14-T00, LXK2-PE14-U00 LXK2-PB12-K00, LXK2-PB12-L00, LXK2-PB12-M00, LXK2-PB14-N00, LXK2-PB14-P00, LXK2-PB14-Q00 LXK2-PR12-L00, LXK2-PR12-M00, LXK2-PR14-Q00, LXK2-PR14-R00 LXK2-PD12-Q00, LXK2-PD12-R00, LXK2-PD12-S00 LXK2-PH12-R00, LXK2-PH12-S00 LXK2-PL12-P00, LXK2-PL12-Q00, LXK2-PL12-R00 Source: www.luxeon.com KINGBRIGHT: KA-3528ASYC Source: www.kingbright.com; DIGIKEY: 160-1447-1-ND; MF: Lite-On; MPN: LTST-C191KRKT
SCREEN1 = Custom_Library:SPI_SCREEN
SPKR = Custom_Library:GBA-SPKR
SV1 = con-lsta:FE06-2: FEMALE HEADER; OC_FARNELL: unknown; OC_NEWARK: unknown
SW_L SW_R = Custom_Library:GBA-SHOULDER-SW
TP1-TP3 = testpad:TP: Test pad
U1 = Custom_Library:TPS61230; DIGIKEY: 296-37761-1-ND; MF: TI; MPN: TPS61230DRCR
U2 = Custom_Library:MCP73871; DIGIKEY: MCP73871-2AAI/ML-ND; MF: Microchip; MPN: MCP73871-2AAI/ML
U4 = Custom_Library:TAS2521; DIGIKEY: 296-35781-1-ND; MF: Texas Instruments; MPN: TAS2521IRGET
U5 = Custom_Library:PIC18F25K80; DIGIKEY: PIC18F25K80-I/MM-ND; MF: Microchip; MPN: PIC18F25K80-I/MM
U6 = Custom_Library:SN74CBT3257C; DIGIKEY: 296-19212-1-ND; MF: Texas Instruments; MPN: SN74CBT3257CRGYR
U7 = Custom_Library:TLV62568; DIGIKEY: 296-46649-1-ND; MF: Texas Instruments; MPN: TLV62568DRLT
U8 = Custom_Library:MAX17040; MF: Maxim Semiconductor; MPN: MAX17043
U$1 = Custom_Library:CSS-1210; MF: Nidec Copal Electronics; MPN: CSS-1210TB
U$2 = Custom_Library:GBA-POT
X1 = con-yamaichi:USB-A003: USB connector; DIGIKEY: 609-4413-ND; MF: Amphenol; MPN: 87583-2010BLF; OC_FARNELL: unknown; OC_NEWARK: unknown